# Altium project MU-RK3576J-MB.PrjPCB (part 5 of 13)

## Sheet CPU_GPIO.SchDoc
size 420 x 297 mm; Scale: 1:1; DocumentType: Схема электрическая принципиальная; SheetNumber: 11; SheetTotal: 32; DocumentTypeShort: Э3; DocumentInvertoryNumber: ㅤ
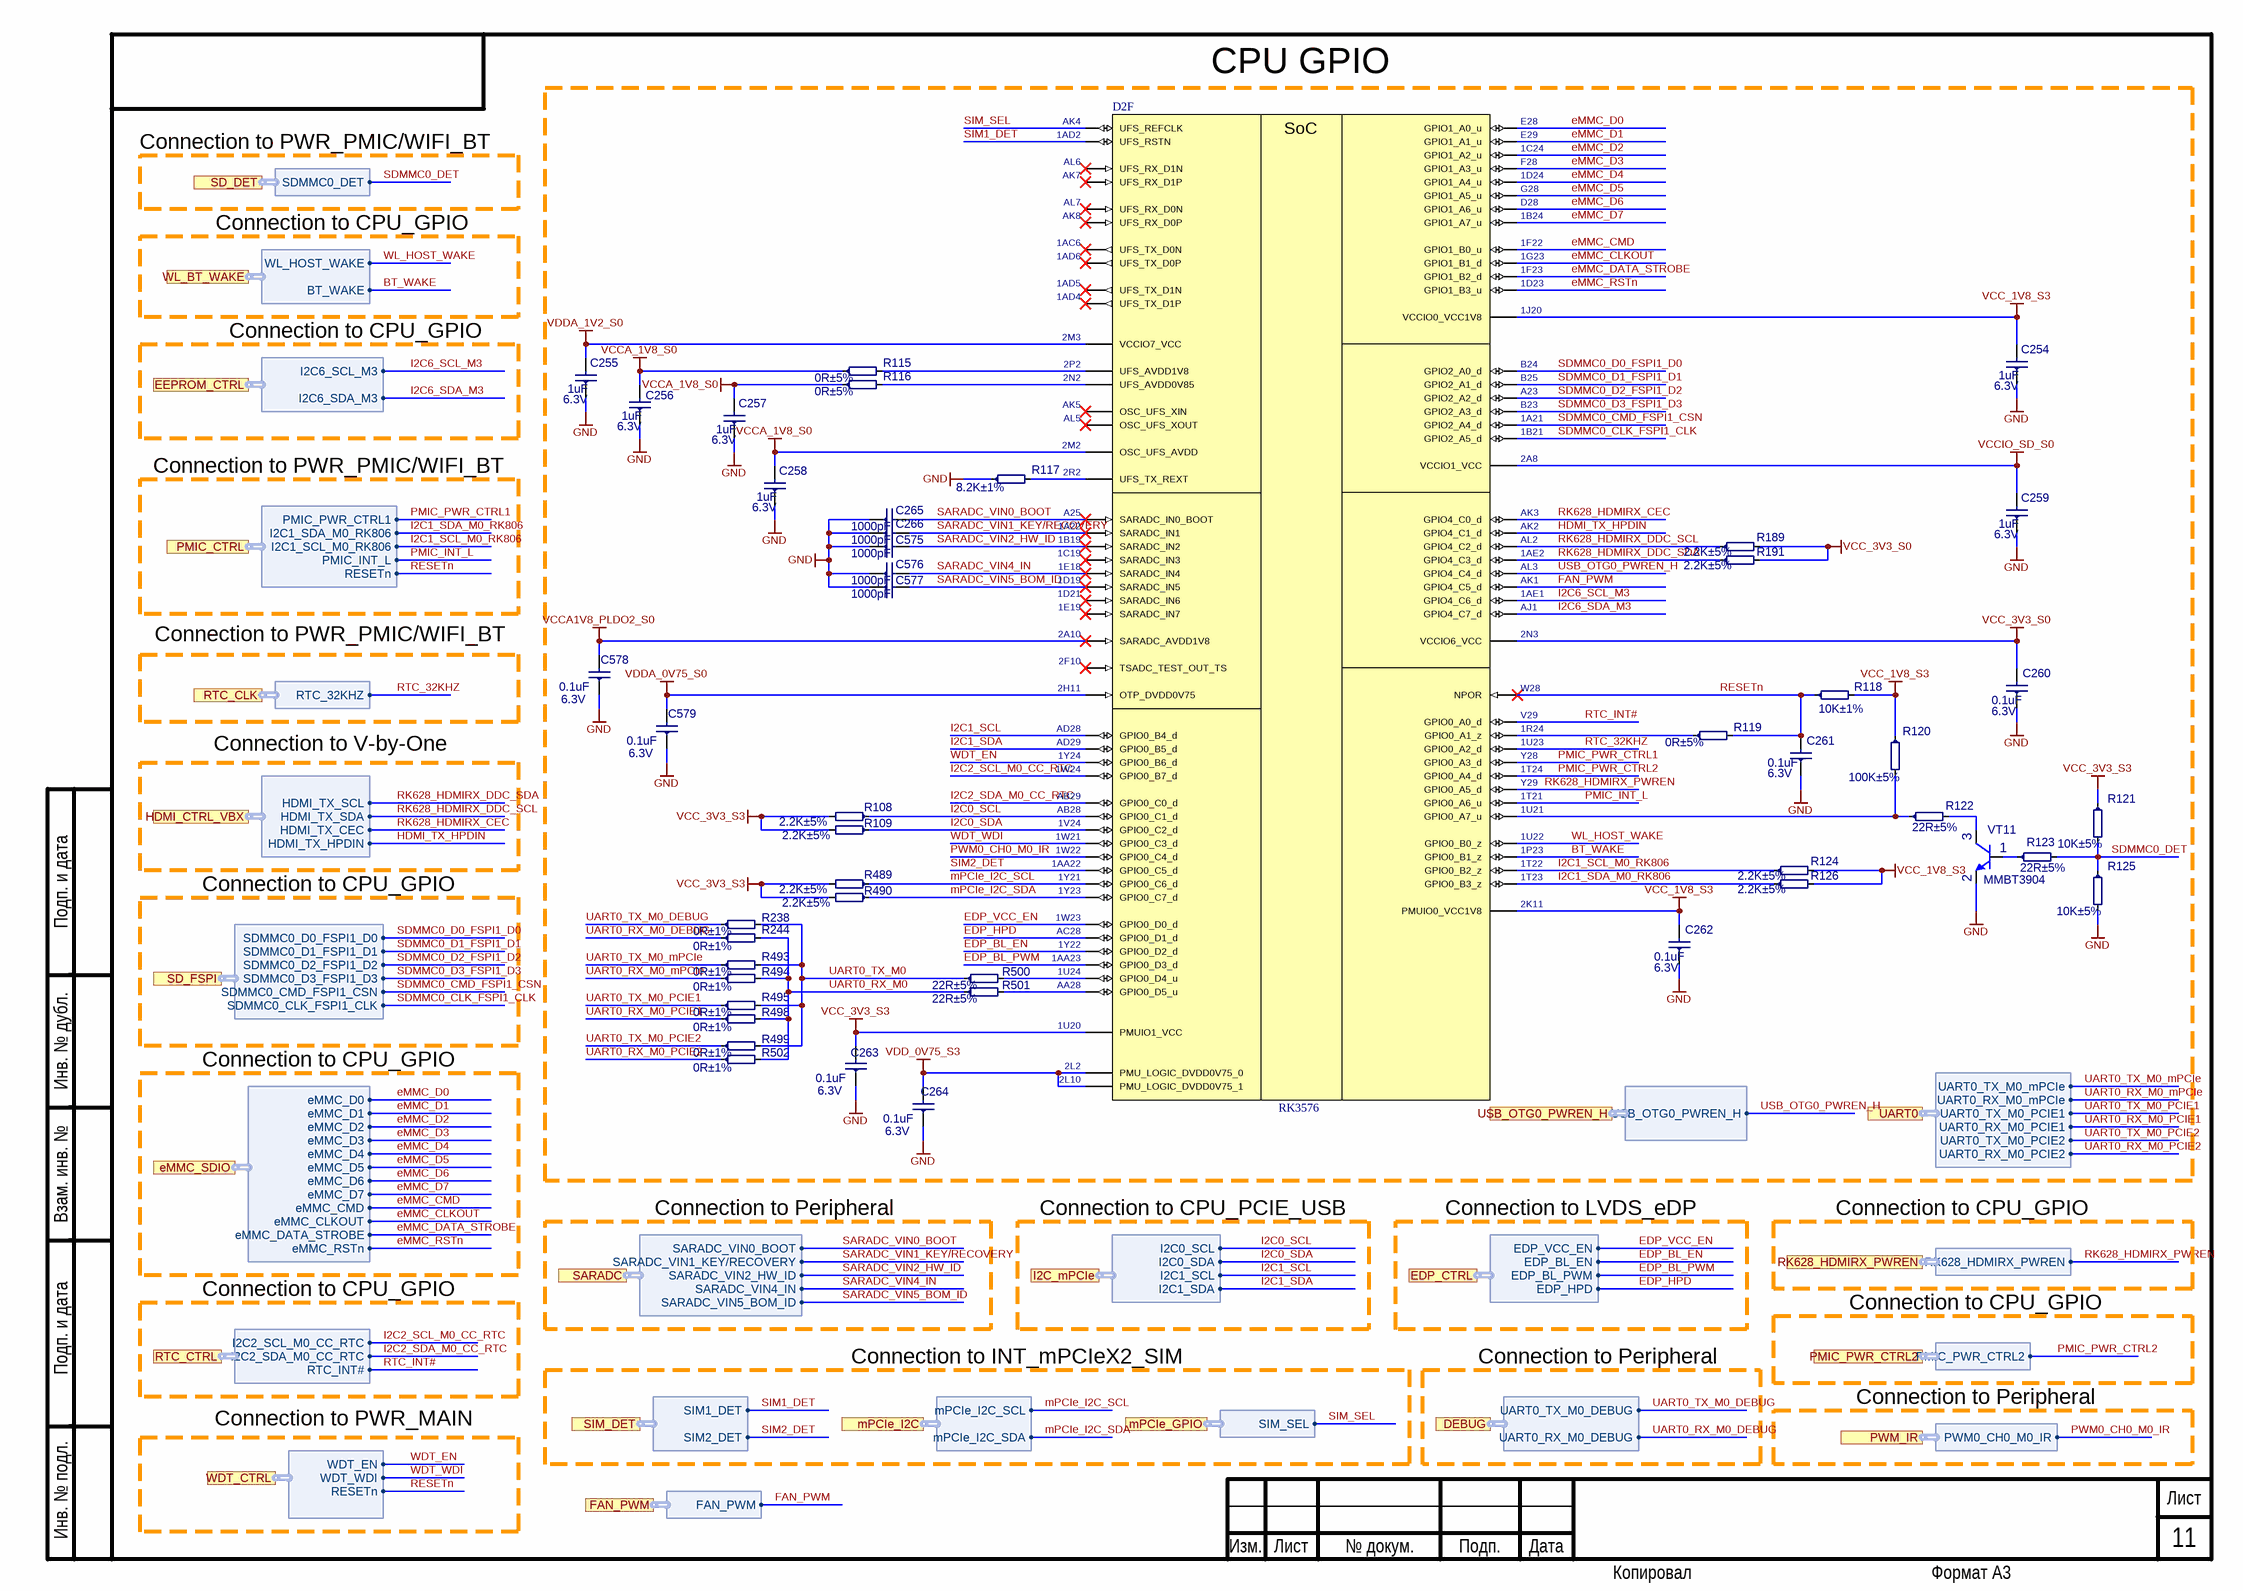
[diagram p10: CPU_GPIO.SchDoc]

### Parts
C254  1uF  Voltage: 6.3V  [C0201]
C255  1uF  Voltage: 6.3V  [C0201]
C256  1uF  Voltage: 6.3V  [C0201]
C257  1uF  Voltage: 6.3V  [C0201]
C258  1uF  Voltage: 6.3V  [C0201]
C259  1uF  Voltage: 6.3V  [C0201]
C260  0.1uF  Voltage: 6.3V  [C0201]
C261  0.1uF  Voltage: 6.3V  [C0201]
C262  0.1uF  Voltage: 6.3V  [C0201]
C263  0.1uF  Voltage: 6.3V  [C0201]
C264  0.1uF  Voltage: 6.3V  [C0201]
C265  1000pF  [C0201]
C266  1000pF  [C0201]
C575  1000pF  [C0201]
C576  1000pF  [C0201]
C577  1000pF  [C0201]
C578  0.1uF  Voltage: 6.3V  [C0201]
C579  0.1uF  Voltage: 6.3V  [C0201]
D2  RK3576  [BGAFCCSP698L]  (part F of 7)
R108  2.2K±5%  [R0402]
R109  2.2K±5%  [R0402]
R115  0R±5%  [R0201]
R116  0R±5%  [R0201]
R117  8.2K±1%  [R0402]
R118  10K±1%  [R0201]
R119  0R±5%  [R0201]
R120  100K±5%  [R0402]
R121  10K±5%  [R0402]
R122  22R±5%  [R0402]
R123  22R±5%  [R0402]
R124  2.2K±5%  [R0402]
R125  10K±5%  [R0402]
R126  2.2K±5%  [R0402]
R189  2.2K±5%  [R0402]
R191  2.2K±5%  [R0402]
R238  0R±1%  [R0402]
R244  0R±1%  [R0402]
R489  2.2K±5%  [R0402]
R490  2.2K±5%  [R0402]
R493  0R±1%  [R0402]
R494  0R±1%  [R0402]
R495  0R±1%  [R0402]
R498  0R±1%  [R0402]
R499  0R±1%  [R0402]
R500  22R±5%  [R0402]
R501  22R±5%  [R0402]
R502  0R±1%  [R0402]
VT11  MMBT3904  [SOT23]

### Ports
DEBUG (harness DEBUG), EDP_CTRL (harness EDP_CTRL), EEPROM_CTRL (harness EEPROM_CTRL), eMMC_SDIO (harness eMMC_SDIO), FAN_PWM (harness FAN_PWM), HDMI_CTRL_VBX (harness HDMI_CTRL_VBX), I2C_mPCIe (harness I2C_mPCIe), mPCIe_GPIO (harness mPCIe_GPIO), mPCIe_I2C (harness mPCIe_I2C), PMIC_CTRL (harness PMIC_CTRL), PMIC_PWR_CTRL2 (harness PMIC_PWR_CTRL2), PWM_IR (harness PWM0_IR), RK628_HDMIRX_PWREN (harness RK628_HDMIRX_PWREN), RTC_CLK (harness RTC_CLK), RTC_CTRL (harness RTC_CTRL), SARADC (harness SARADC), SD_DET (harness SD_DET), SD_FSPI (harness SD_FSPI), SIM_DET (harness SIM_DET), UART0 (harness UART0), USB_OTG0_PWREN_H (harness USB_OTG0_PWREN_H), WDT_CTRL (harness WDT_CTRL), WL_BT_WAKE (harness WL_BT_WAKE)

### Harnesses
WDT_CTRL: WDT_WDI, WDT_EN, RESETn
RTC_CLK: RTC_32KHZ
RTC_CTRL: I2C2_SCL_M0_CC_RTC, I2C2_SDA_M0_CC_RTC, RTC_INT#
eMMC_SDIO: eMMC_D0, eMMC_D1, eMMC_D2, eMMC_D3, eMMC_D4, eMMC_D5, eMMC_D6, eMMC_D7, eMMC_CMD, eMMC_CLKOUT, eMMC_DATA_STROBE, eMMC_RSTn
SD_FSPI: SDMMC0_D0_FSPI1_D0, SDMMC0_D1_FSPI1_D1, SDMMC0_D2_FSPI1_D2, SDMMC0_D3_FSPI1_D3, SDMMC0_CMD_FSPI1_CSN, SDMMC0_CLK_FSPI1_CLK
EEPROM_CTRL: I2C6_SCL_M3, I2C6_SDA_M3
SD_DET: SDMMC0_DET
WL_BT_WAKE: WL_HOST_WAKE, BT_WAKE
HDMI_CTRL_VBX: HDMI_TX_SDA, HDMI_TX_CEC, HDMI_TX_SCL, HDMI_TX_HPDIN
EDP_CTRL: EDP_BL_EN, EDP_BL_PWM, EDP_VCC_EN, EDP_HPD
SARADC: SARADC_VIN4_IN, SARADC_VIN2_HW_ID, SARADC_VIN1_KEY/RECOVERY, SARADC_VIN0_BOOT, SARADC_VIN5_BOM_ID
PMIC_CTRL: I2C1_SDA_M0_RK806, I2C1_SCL_M0_RK806, PMIC_PWR_CTRL1, PMIC_INT_L, RESETn
mPCIe_GPIO: SIM_SEL
SIM_DET: SIM1_DET, SIM2_DET
mPCIe_I2C: mPCIe_I2C_SDA, mPCIe_I2C_SCL
RK628_HDMIRX_PWREN: RK628_HDMIRX_PWREN
PMIC_PWR_CTRL2: PMIC_PWR_CTRL2
PWM0_IR: PWM0_CH0_M0_IR
I2C_mPCIe: I2C0_SDA, I2C1_SCL, I2C0_SCL, I2C1_SDA
DEBUG: UART0_RX_M0_DEBUG, UART0_TX_M0_DEBUG
FAN_PWM: FAN_PWM
UART0: UART0_RX_M0_PCIE2, UART0_TX_M0_PCIE2, UART0_RX_M0_PCIE1, UART0_TX_M0_PCIE1, UART0_RX_M0_mPCIe, UART0_TX_M0_mPCIe
USB_OTG0_PWREN_H: USB_OTG0_PWREN_H

### Nets
GND: C254.1 C255.1 C256.1 C257.1 C258.1 C259.1 C260.1 C261.1 C262.1 C263.1 C264.1 C265.1 C266.1 C575.1 C576.1 C577.1 C578.1 C579.1 R117.1 R125.2 VT11.2(E)
VCC_1V8_S3: C254.2 C262.2 D2.1J20(VCCIO0_VCC1V8) D2.2K11(PMUIO0_VCC1V8) R118.2 R120.1 R124.2 R126.2
VCC_3V3_S0: C260.2 D2.2N3(VCCIO6_VCC) R189.2 R191.2
VCC_3V3_S3: C263.2 D2.1U20(PMUIO1_VCC) R108.2 R109.2 R121.1 R489.2 R490.2
VCCA1V8_PLDO2_S0: C578.2 D2.2A10(SARADC_AVDD1V8)
VCCA_1V8_S0: C256.2 C257.2 C258.2 D2.2M2(OSC_UFS_AVDD) R115.1 R116.1
VCCIO_SD_S0: C259.2 D2.2A8(VCCIO1_VCC)
VDD_0V75_S3: C264.2 D2.2L2(PMU_LOGIC_DVDD0V75_0) D2.2L10(PMU_LOGIC_DVDD0V75_1)
VDDA_0V75_S0: C579.2 D2.2H11(OTP_DVDD0V75)
VDDA_1V2_S0: C255.2 D2.2M3(VCCIO7_VCC)
BT_WAKE: D2.1P23(GPIO0_B1_z) ; port WL_BT_WAKE.BT_WAKE
EDP_BL_EN: D2.1Y22(GPIO0_D2_d) ; port EDP_CTRL.EDP_BL_EN
EDP_BL_PWM: D2.1AA23(GPIO0_D3_d) ; port EDP_CTRL.EDP_BL_PWM
EDP_HPD: D2.AC28(GPIO0_D1_d) ; port EDP_CTRL.EDP_HPD  [project net EDP_CTRL.EDP_HPD]
EDP_VCC_EN: D2.1W23(GPIO0_D0_d) ; port EDP_CTRL.EDP_VCC_EN  [project net EDP_CTRL.EDP_VCC_EN]
eMMC_CLKOUT: D2.1G23(GPIO1_B1_d) ; port eMMC_SDIO.eMMC_CLKOUT
eMMC_CMD: D2.1F22(GPIO1_B0_u) ; port eMMC_SDIO.eMMC_CMD
eMMC_D0: D2.E28(GPIO1_A0_u) ; port eMMC_SDIO.eMMC_D0
eMMC_D1: D2.E29(GPIO1_A1_u) ; port eMMC_SDIO.eMMC_D1
eMMC_D2: D2.1C24(GPIO1_A2_u) ; port eMMC_SDIO.eMMC_D2
eMMC_D3: D2.F28(GPIO1_A3_u) ; port eMMC_SDIO.eMMC_D3
eMMC_D4: D2.1D24(GPIO1_A4_u) ; port eMMC_SDIO.eMMC_D4
eMMC_D5: D2.G28(GPIO1_A5_u) ; port eMMC_SDIO.eMMC_D5
eMMC_D6: D2.D28(GPIO1_A6_u) ; port eMMC_SDIO.eMMC_D6
eMMC_D7: D2.1B24(GPIO1_A7_u) ; port eMMC_SDIO.eMMC_D7
eMMC_DATA_STROBE: D2.1F23(GPIO1_B2_d) ; port eMMC_SDIO.eMMC_DATA_STROBE
eMMC_RSTn: D2.1D23(GPIO1_B3_u) ; port eMMC_SDIO.eMMC_RSTn
FAN_PWM: D2.AK1(GPIO4_C5_d) ; port FAN_PWM.FAN_PWM
HDMI_TX_HPDIN: D2.AK2(GPIO4_C1_d) ; port HDMI_CTRL_VBX.HDMI_TX_HPDIN  [project net HDMI_CTRL_VBX.HDMI_TX_HPDIN]
I2C0_SCL: D2.AB28(GPIO0_C1_d) R108.1 ; port I2C_mPCIe.I2C0_SCL
I2C0_SDA: D2.1V24(GPIO0_C2_d) R109.1 ; port I2C_mPCIe.I2C0_SDA
I2C1_SCL: D2.AD28(GPIO0_B4_d) ; port I2C_mPCIe.I2C1_SCL
I2C1_SCL_M0_RK806: D2.1T22(GPIO0_B2_z) R124.1 ; port PMIC_CTRL.I2C1_SCL_M0_RK806
I2C1_SDA: D2.AD29(GPIO0_B5_d) ; port I2C_mPCIe.I2C1_SDA
I2C1_SDA_M0_RK806: D2.1T23(GPIO0_B3_z) R126.1 ; port PMIC_CTRL.I2C1_SDA_M0_RK806
I2C2_SCL_M0_CC_RTC: D2.1W24(GPIO0_B7_d) ; port RTC_CTRL.I2C2_SCL_M0_CC_RTC
I2C2_SDA_M0_CC_RTC: D2.AB29(GPIO0_C0_d) ; port RTC_CTRL.I2C2_SDA_M0_CC_RTC
I2C6_SCL_M3: D2.1AE1(GPIO4_C6_d) ; port EEPROM_CTRL.I2C6_SCL_M3  [project net EEPROM_CTRL.I2C6_SCL_M3]
I2C6_SDA_M3: D2.AJ1(GPIO4_C7_d) ; port EEPROM_CTRL.I2C6_SDA_M3  [project net EEPROM_CTRL.I2C6_SDA_M3]
mPCIe_I2C_SCL: D2.1Y21(GPIO0_C6_d) R489.1 ; port mPCIe_I2C.mPCIe_I2C_SCL  [project net mPCIe_I2C.mPCIe_I2C_SCL]
mPCIe_I2C_SDA: D2.1Y23(GPIO0_C7_d) R490.1 ; port mPCIe_I2C.mPCIe_I2C_SDA  [project net mPCIe_I2C.mPCIe_I2C_SDA]
PMIC_INT_L: D2.1T21(GPIO0_A6_u) ; port PMIC_CTRL.PMIC_INT_L  [project net PMIC_CTRL.PMIC_INT_L]
PMIC_PWR_CTRL1: D2.Y28(GPIO0_A3_d) ; port PMIC_CTRL.PMIC_PWR_CTRL1  [project net PMIC_CTRL.PMIC_PWR_CTRL1]
PMIC_PWR_CTRL2: D2.1T24(GPIO0_A4_d) ; port PMIC_PWR_CTRL2.PMIC_PWR_CTRL2
PWM0_CH0_M0_IR: D2.1W22(GPIO0_C4_d) ; port PWM_IR.PWM0_CH0_M0_IR
RESETn: C261.2 D2.W28(NPOR) R118.1 R119.2 ; port WDT_CTRL.RESETn, port PMIC_CTRL.RESETn  [project net PMIC_CTRL.RESETn]
RK628_HDMIRX_CEC: D2.AK3(GPIO4_C0_d) ; port HDMI_CTRL_VBX.HDMI_TX_CEC  [project net HDMI_CTRL_VBX.HDMI_TX_CEC]
RK628_HDMIRX_DDC_SCL: D2.AL2(GPIO4_C2_d) R189.1 ; port HDMI_CTRL_VBX.HDMI_TX_SDA  [project net HDMI_CTRL_VBX.HDMI_TX_SDA]
RK628_HDMIRX_DDC_SDA: D2.1AE2(GPIO4_C3_d) R191.1 ; port HDMI_CTRL_VBX.HDMI_TX_SCL  [project net HDMI_CTRL_VBX.HDMI_TX_SCL]
RK628_HDMIRX_PWREN: D2.Y29(GPIO0_A5_d) ; port RK628_HDMIRX_PWREN.RK628_HDMIRX_PWREN
RTC_32KHZ: D2.1U23(GPIO0_A2_d) ; port RTC_CLK.RTC_32KHZ
RTC_INT#: D2.V29(GPIO0_A0_d) ; port RTC_CTRL.RTC_INT#  [project net RTC_CTRL.RTC_INT#]
SARADC_VIN0_BOOT: C265.2 D2.A25(SARADC_IN0_BOOT) ; port SARADC.SARADC_VIN0_BOOT  [project net SARADC.SARADC_VIN0_BOOT]
SARADC_VIN1_KEY/RECOVERY: C266.2 D2.1A22(SARADC_IN1) ; port SARADC.SARADC_VIN1_KEY/RECOVERY  [project net SARADC.SARADC_VIN1_KEY/RECOVERY]
SARADC_VIN2_HW_ID: C575.2 D2.1B19(SARADC_IN2) ; port SARADC.SARADC_VIN2_HW_ID  [project net SARADC.SARADC_VIN2_HW_ID]
SARADC_VIN4_IN: C576.2 D2.1E18(SARADC_IN4) ; port SARADC.SARADC_VIN4_IN  [project net SARADC.SARADC_VIN4_IN]
SARADC_VIN5_BOM_ID: C577.2 D2.1D19(SARADC_IN5) ; port SARADC.SARADC_VIN5_BOM_ID  [project net SARADC.SARADC_VIN5_BOM_ID]
SDMMC0_CLK_FSPI1_CLK: D2.1B21(GPIO2_A5_d) ; port SD_FSPI.SDMMC0_CLK_FSPI1_CLK  [project net SD_FSPI.SDMMC0_CLK_FSPI1_CLK]
SDMMC0_CMD_FSPI1_CSN: D2.1A21(GPIO2_A4_d) ; port SD_FSPI.SDMMC0_CMD_FSPI1_CSN  [project net SD_FSPI.SDMMC0_CMD_FSPI1_CSN]
SDMMC0_D0_FSPI1_D0: D2.B24(GPIO2_A0_d) ; port SD_FSPI.SDMMC0_D0_FSPI1_D0  [project net SD_FSPI.SDMMC0_D0_FSPI1_D0]
SDMMC0_D1_FSPI1_D1: D2.B25(GPIO2_A1_d) ; port SD_FSPI.SDMMC0_D1_FSPI1_D1  [project net SD_FSPI.SDMMC0_D1_FSPI1_D1]
SDMMC0_D2_FSPI1_D2: D2.A23(GPIO2_A2_d) ; port SD_FSPI.SDMMC0_D2_FSPI1_D2  [project net SD_FSPI.SDMMC0_D2_FSPI1_D2]
SDMMC0_D3_FSPI1_D3: D2.B23(GPIO2_A3_d) ; port SD_FSPI.SDMMC0_D3_FSPI1_D3  [project net SD_FSPI.SDMMC0_D3_FSPI1_D3]
SDMMC0_DET: R121.2 R123.2 R125.1 ; port SD_DET.SDMMC0_DET  [project net SD_DET.SDMMC0_DET]
SIM1_DET: D2.1AD2(UFS_RSTN) ; port SIM_DET.SIM1_DET
SIM2_DET: D2.1AA22(GPIO0_C5_d) ; port SIM_DET.SIM2_DET
SIM_SEL: D2.AK4(UFS_REFCLK) ; port mPCIe_GPIO.SIM_SEL  [project net mPCIe_GPIO.SIM_SEL]
UART0_RX_M0: R244.2 R494.2 R498.2 R501.1 R502.2
UART0_RX_M0_DEBUG: R244.1 ; port DEBUG.UART0_RX_M0_DEBUG  [project net DEBUG.UART0_RX_M0_DEBUG]
UART0_RX_M0_mPCIe: R494.1 ; port UART0.UART0_RX_M0_mPCIe  [project net UART0.UART0_RX_M0_mPCIe]
UART0_RX_M0_PCIE1: R498.1 ; port UART0.UART0_RX_M0_PCIE1  [project net UART0.UART0_RX_M0_PCIE1]
UART0_RX_M0_PCIE2: R502.1 ; port UART0.UART0_RX_M0_PCIE2  [project net UART0.UART0_RX_M0_PCIE2]
UART0_TX_M0: R238.2 R493.2 R495.2 R499.2 R500.1
UART0_TX_M0_DEBUG: R238.1 ; port DEBUG.UART0_TX_M0_DEBUG  [project net DEBUG.UART0_TX_M0_DEBUG]
UART0_TX_M0_mPCIe: R493.1 ; port UART0.UART0_TX_M0_mPCIe  [project net UART0.UART0_TX_M0_mPCIe]
UART0_TX_M0_PCIE1: R495.1 ; port UART0.UART0_TX_M0_PCIE1  [project net UART0.UART0_TX_M0_PCIE1]
UART0_TX_M0_PCIE2: R499.1 ; port UART0.UART0_TX_M0_PCIE2  [project net UART0.UART0_TX_M0_PCIE2]
USB_OTG0_PWREN_H: D2.AL3(GPIO4_C4_d) ; port USB_OTG0_PWREN_H.USB_OTG0_PWREN_H
WDT_EN: D2.1Y24(GPIO0_B6_d) ; port WDT_CTRL.WDT_EN  [project net WDT_CTRL.WDT_EN]
WDT_WDI: D2.1W21(GPIO0_C3_d) ; port WDT_CTRL.WDT_WDI  [project net WDT_CTRL.WDT_WDI]
WL_HOST_WAKE: D2.1U22(GPIO0_B0_z) ; port WL_BT_WAKE.WL_HOST_WAKE  [project net WL_BT_WAKE.WL_HOST_WAKE]
NetD2_1R24: D2.1R24(GPIO0_A1_z) R119.1
NetD2_1U21: D2.1U21(GPIO0_A7_u) R120.2 R122.1
NetD2_1U24: D2.1U24(GPIO0_D4_u) R500.2
NetD2_2N2: D2.2N2(UFS_AVDD0V85) R116.2
NetD2_2P2: D2.2P2(UFS_AVDD1V8) R115.2
NetD2_2R2: D2.2R2(UFS_TX_REXT) R117.2
NetD2_AA28: D2.AA28(GPIO0_D5_u) R501.2
NetR122_2: R122.2 VT11.3(C)
NetR123_1: R123.1 VT11.1(B)

Not connected (* = marked no-connect by the designer): D2 1AC6(UFS_TX_D0N)* 1AD4(UFS_TX_D1P)* 1AD5(UFS_TX_D1N)* 1AD6(UFS_TX_D0P)* 1C19(SARADC_IN3)* 1D21(SARADC_IN6)* 1E19(SARADC_IN7)* 2F10(TSADC_TEST_OUT_TS)* AK5(OSC_UFS_XIN)* AK7(UFS_RX_D1P)* AK8(UFS_RX_D0P)* AL5(OSC_UFS_XOUT)* AL6(UFS_RX_D1N)* AL7(UFS_RX_D0N)*

### Notes on the sheet
- (near D2) CPU GPIO
- Connection to PWR_PMIC/WIFI_BT
- Connection to CPU_GPIO
- Connection to V-by-One
- Connection to Peripheral
- Connection to CPU_PCIE_USB
- Connection to LVDS_eDP
- Connection to INT_mPCIeX2_SIM
- Connection to PWR_MAIN
- Подп. и дата
- Инв. № дубл.
- Взам. инв. №
- Инв. № подл.
- Изм.
- Лист
- № докум.
- Подп.
- Дата
- Копировал
- Формат А3
- (in symbol RK3576, part F) SoC

### Library data of the parts
C254-C259 = 0201-X5R-6.3V-1uF±20%: Manufacturer: Murata Electronics; NameFromManufacturer: GRM033R60J105MEA2D; Dielectric: X5R; Place: *); Tolerance: 20%; Check: False; Case: C0201; Part Number: 0201-X5R-6.3V-1uF±20%; Value: 1uF; Temperature: -55°C~85°C; ComponentLink2Description: Link to datasheet; ComponentLink1Description: DATASHEET; ComponentLink2URL: https://www.terraelectronica.ru/product/1209278; ComponentLink1URL: Datasheets/capacitors/GRM033R60J105MEA2-61A.pdf; Last changed: 27.10.2022
C260-C264 C578 C579 = 0201-X5R-6.3V-0.1uF±10%: Manufacturer: Yageo; NameFromManufacturer: CC0201KRX5R5BB104; Dielectric: X5R; Place: *); Tolerance: 10%; Check: False; Case: C0201; Part Number: 0201-X5R-6.3V-0.1uF±10%; Value: 0.1uF; Temperature: -55°C~85°C; ComponentLink2Description: Link to datasheet; ComponentLink1Description: DATASHEET; ComponentLink2URL: https://www.terraelectronica.ru/product/1020032; ComponentLink1URL: Datasheets/capacitors/UPY-GPHC_X5R_4V-to-50V_27.pdf; Last changed: 27.10.2022
C265 C266 C575-C577 = 0201-C0G-25V-100pF±5%: *; Part Number: 0201-C0G-25V-1000pF±10%; Manufacturer: Yageo; NameFromManufacturer: CC0201KRX7R9BB102; Dielectric: C0G; Voltage: 25V; Place: *); Tolerance: 10%; Check: False; Case: C0201; Value: 1000pF; Temperature: -55°C~125°C; ComponentLink2Description: Link to datasheet; ComponentLink1Description: DATASHEET; ComponentLink2URL: https://ru.mouser.com/ProductDetail/YAGEO/CC0201JRNPO8BN101?qs=%2Fha2pyFaduhl6p6a7Jtfij5kOT7C0BCbN0eDEcSOi5wWtTVDmUsGTw%3D%3D; ComponentLink1URL: Datasheets/capacitors/UPY-GP_NP0_16V-to-50V_18.pdf; Last changed: 27.10.2022
D2 = RK3576: SoC 4xCortex-A72@2.2Ghz+4xCortex-A53@2Ghz, LPDDR4/4X/5/5X, SDIO/eMMC/UFS/FSPI, BGA 16.1x17.2x1.0mm; Manufacturer: Rockship; Place: *); Check: False; Part Number: RK3576; Temperature: -40°C~85°C; Value: RK3576; ComponentLink1Description: DATASHEET; NameFromManufacturer: RK3576; ComponentLink1URL: https://wiki.friendlyelec.com/wiki/images/b/bf/Rockchip_RK3576_Datasheet_V1.5-20241216.pdf; Last changed: 06.01.2026
R108 R109 R124 R126 R189 R191 R489 R490 = 0402-0.0625W-2.2K-100ppm±5%: *; NameFromManufacturer: RC0402JR-072K2L; Manufacturer: Yageo; Place: *); Value: 2.2K; Tolerance: 5%; Check: False; Case: R0402; Part Number: 0402-0.0625W-2.2K-100ppm±5%; Temperature: -55°C~155°C; ComponentLink1Description: DATASHEET; ComponentLink1URL: https://octopart.com/ac0402jr-072k2l-yageo-23514430?r=sp; Datasheet: Datasheets/resistors/PYu-AC_51_RoHS_L_8.pdf; Last changed: 27.10.2022
R115 R116 R119 = 0201-0.05W-0R-100ppm-5%: *; NameFromManufacturer: RC0201JR-070RL; Manufacturer: Yageo; Place: *); Value: 0R; Tolerance: 5%; Check: False; Case: R0201; Part Number: 0201-0.05W-0R-100ppm-5%; Temperature: -40°C~125°C; ComponentLink1Description: DATASHEET; ComponentLink1URL: https://www.digikey.com/en/products/detail/yageo/RC0201JR-070RL/1948898; Datasheet: Datasheets/resistors/PYu-RC_Group_51_RoHS_L_11.pdf+BB3:B271; Last changed: 27.10.2022
R117 = 0402-0.0625W-8.2K-100ppm±1%: NameFromManufacturer: RC0402FR-078K2L; Manufacturer: Yageo; Place: *); Value: 8.2K; Tolerance: 1%; Check: False; Case: R0402; Part Number: 0402-0.0625W-8.2K-100ppm±1%; Temperature: -55°C~155°C; ComponentLink1Description: DATASHEET; ComponentLink1URL: https://www.compel.ru/infosheet/YAG/RC0402FR-078K2L; Datasheet: Datasheets/resistors/PYu-RC_Group_51_RoHS_L_11.pdf; Last changed: 27.10.2022
R118 = 0201-0.05W-10K-200ppm-1%: *; NameFromManufacturer: RC0201FR-0710KL; Manufacturer: Yageo; Place: *); Value: 10K; Tolerance: 1%; Check: False; Case: R0201; Part Number: 0201-0.05W-10K-200ppm-1%; Temperature: -40°C~125°C; ComponentLink1Description: DATASHEET; ComponentLink1URL: https://www.terraelectronica.ru/product/597744; Datasheet: Datasheets/resistors/PYu-RC_Group_51_RoHS_L_11.pdf; Last changed: 09.11.2022
R120 = 0402-0.0625W-100K-100ppm±5%: NameFromManufacturer: RC0402JR-07100KL; Manufacturer: Yageo; Place: *); Value: 100K; Tolerance: 5%; Check: False; Case: R0402; Part Number: 0402-0.0625W-100K-100ppm±5%; Temperature: -55°C~155°C; ComponentLink1Description: DATASHEET; ComponentLink1URL: https://ru.mouser.com/ProductDetail/YAGEO/RC0402JR-07100KL?qs=%2Fha2pyFadugNN0LzwXn2qCsICuw6vgLBeLL%252BmXUKy2OLGS9kgqrNBA%3D%3D; Datasheet: Datasheets/resistors/PYu-RC_Group_51_RoHS_L_11.pdf; Last changed: 27.10.2022
R121 R125 = 0402-0.0625W-10K-100ppm±5%: NameFromManufacturer: RC0402JR-0710KL; Manufacturer: Yageo; Place: *); Value: 10K; Tolerance: 5%; Check: False; Case: R0402; Part Number: 0402-0.0625W-10K-100ppm±5%; Temperature: -55°C~155°C; ComponentLink1Description: DATASHEET; ComponentLink1URL: https://ru.mouser.com/ProductDetail/YAGEO/RC0402JR-0710KL?qs=%2Fha2pyFadugNN0LzwXn2qF8HRAp201xOpXu%252BapQnyvRGE%2F%252Bpr1TWjQ%3D%3D; Datasheet: Datasheets/resistors/PYu-RC_Group_51_RoHS_L_11.pdf; Last changed: 27.10.2022
R122 R123 R500 R501 = 0402-0.0625W-22R-100ppm±5%: NameFromManufacturer: RC0402JR-0722RL; Manufacturer: Yageo; Place: *); Value: 22R; Tolerance: 5%; Check: False; Case: R0402; Part Number: 0402-0.0625W-22R-100ppm±5%; Temperature: -55°C~155°C; ComponentLink1Description: DATASHEET; ComponentLink1URL: https://www.terraelectronica.ru/pdf/show?pdf_file=%252Fds%252Fpdf%252FR%252FRC0402.pdf; Datasheet: Datasheets/resistors/PYu-RC_Group_51_RoHS_L_12.pdf; Last changed: 27.10.2022
R238 R244 R493-R495 R498 R499 R502 = 0402-0.0625W-0R-100ppm±1%: Chip Resistor 0402 0Ω ±1% 50V ±100ppm/℃ Thick Film; NameFromManufacturer: RC0402FR-070RL; Manufacturer: Yageo; Place: *); Value: 0R; Check: False; Case: R0402; Part Number: 0402-0.0625W-0R-100ppm±1%; Tolerance: 1%; Temperature: -55°C~155°C; ComponentLink1Description: DATASHEET; ComponentLink1URL: https://www.chipdip.ru/product0/8000617426?ysclid=l7og5x0plo427794326; Datasheet: Datasheets/resistors/DOC012445956.pdf; Last changed: 27.10.2022
VT11 = MMBT3904: NPN transistor; Manufacturer: Diotec Semiconductor; Place: S; Voltage: 40V; Check: False; Part Number: MMBT3904; Value: MMBT3904; Temperature: -55°C~150°C; ComponentLink1Description: DATASHEET; NameFromManufacturer: MMBT3904; ComponentLink1URL: https://www.terraelectronica.ru/product/607582; Datasheet: #https://diotec.com/request/datasheet/mmbt3904.pdf#; Last changeв: 01.09.2022

## Sheet MEMORY.SchDoc
size 420 x 297 mm; SheetNumber: 12; SheetTotal: 32; DocumentTypeShort: Э3; DocumentInvertoryNumber: ㅤ
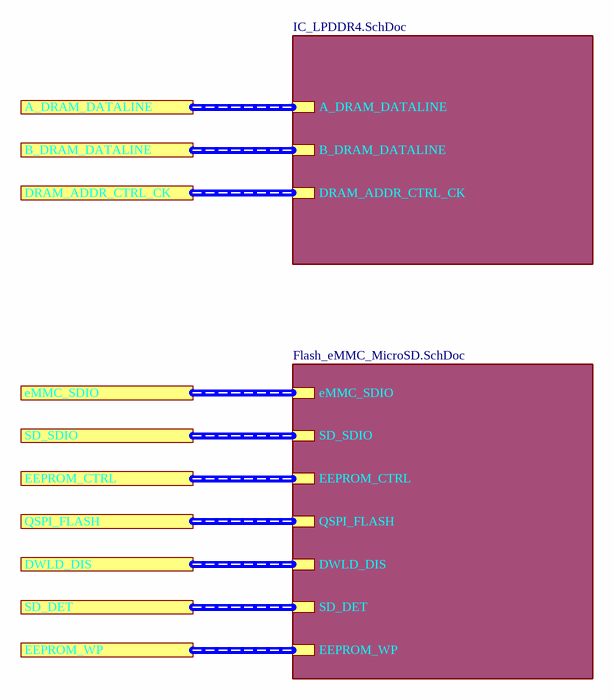
[diagram p11: MEMORY.SchDoc]

### Sub-sheets
Flash_eMMC_MicroSD = Flash_eMMC_MicroSD.SchDoc: eMMC_SDIO (harness eMMC_SDIO), SD_SDIO (harness SD_SDIO), EEPROM_CTRL (harness EEPROM_CTRL), DWLD_DIS (harness DWLD_DIS), SD_DET (harness SD_DET), QSPI_FLASH (harness QSPI_FLASH), EEPROM_WP (harness EEPROM_WP)
IC_LPDDR4 = IC_LPDDR4.SchDoc: A_DRAM_DATALINE (harness A_DRAM_DATALINE), B_DRAM_DATALINE (harness B_DRAM_DATALINE), DRAM_ADDR_CTRL_CK (harness DRAM_ADDR_CTRL_CK)

### Ports
A_DRAM_DATALINE, B_DRAM_DATALINE, DRAM_ADDR_CTRL_CK, DWLD_DIS, EEPROM_CTRL, EEPROM_WP, eMMC_SDIO, QSPI_FLASH, SD_DET, SD_SDIO

### Buses and harness runs
harness port A_DRAM_DATALINE = sheet IC_LPDDR4/A_DRAM_DATALINE
harness port B_DRAM_DATALINE = sheet IC_LPDDR4/B_DRAM_DATALINE
harness port DRAM_ADDR_CTRL_CK = sheet IC_LPDDR4/DRAM_ADDR_CTRL_CK
harness port DWLD_DIS = sheet Flash_eMMC_MicroSD/DWLD_DIS
harness port EEPROM_CTRL = sheet Flash_eMMC_MicroSD/EEPROM_CTRL
harness port EEPROM_WP = sheet Flash_eMMC_MicroSD/EEPROM_WP
harness port eMMC_SDIO = sheet Flash_eMMC_MicroSD/eMMC_SDIO
harness port QSPI_FLASH = sheet Flash_eMMC_MicroSD/QSPI_FLASH
harness port SD_DET = sheet Flash_eMMC_MicroSD/SD_DET
harness port SD_SDIO = sheet Flash_eMMC_MicroSD/SD_SDIO

### Notes on the sheet
- Подп. и дата
- Инв. № дубл.
- Взам. инв. №
- Инв. № подл.
- Изм.
- Лист
- № докум.
- Подп.
- Дата
- Копировал
- Формат А3

## Sheet IC_LPDDR4.SchDoc
size 420 x 297 mm; Title1str: Модуль; PageSetup: Record=PageOptions|CenterHorizontal=False|CenterVertical=False|PrintScale=0.95|XCorrection=0.00|YCorrection=0.00|PrintKind=1|BorderSize=5000000|LeftOffset=0|BottomOffset=0|Orientation=1|PaperLength=1000|PaperWidth=1000|Scale=100|PaperSource=15|PrintQuality=600|MediaType=1|DitherType=10|PaperKind=A4|PrintScaleMode=1; Title2str: ATB-LW-USB-GateWay; Mass: ---; Letter1Column: О; Letter2Column: {L}; DocumentType1str: {Документ}; DocumentType2str: {Документ}; SpravNomer: {Справ. №}; Scale: 1:1; DocumentType: Схема электрическая принципиальная; SheetNumber: 13; SheetTotal: 32; DocumentTypeShort: Э3; DocumentInvertoryNumber: ㅤ
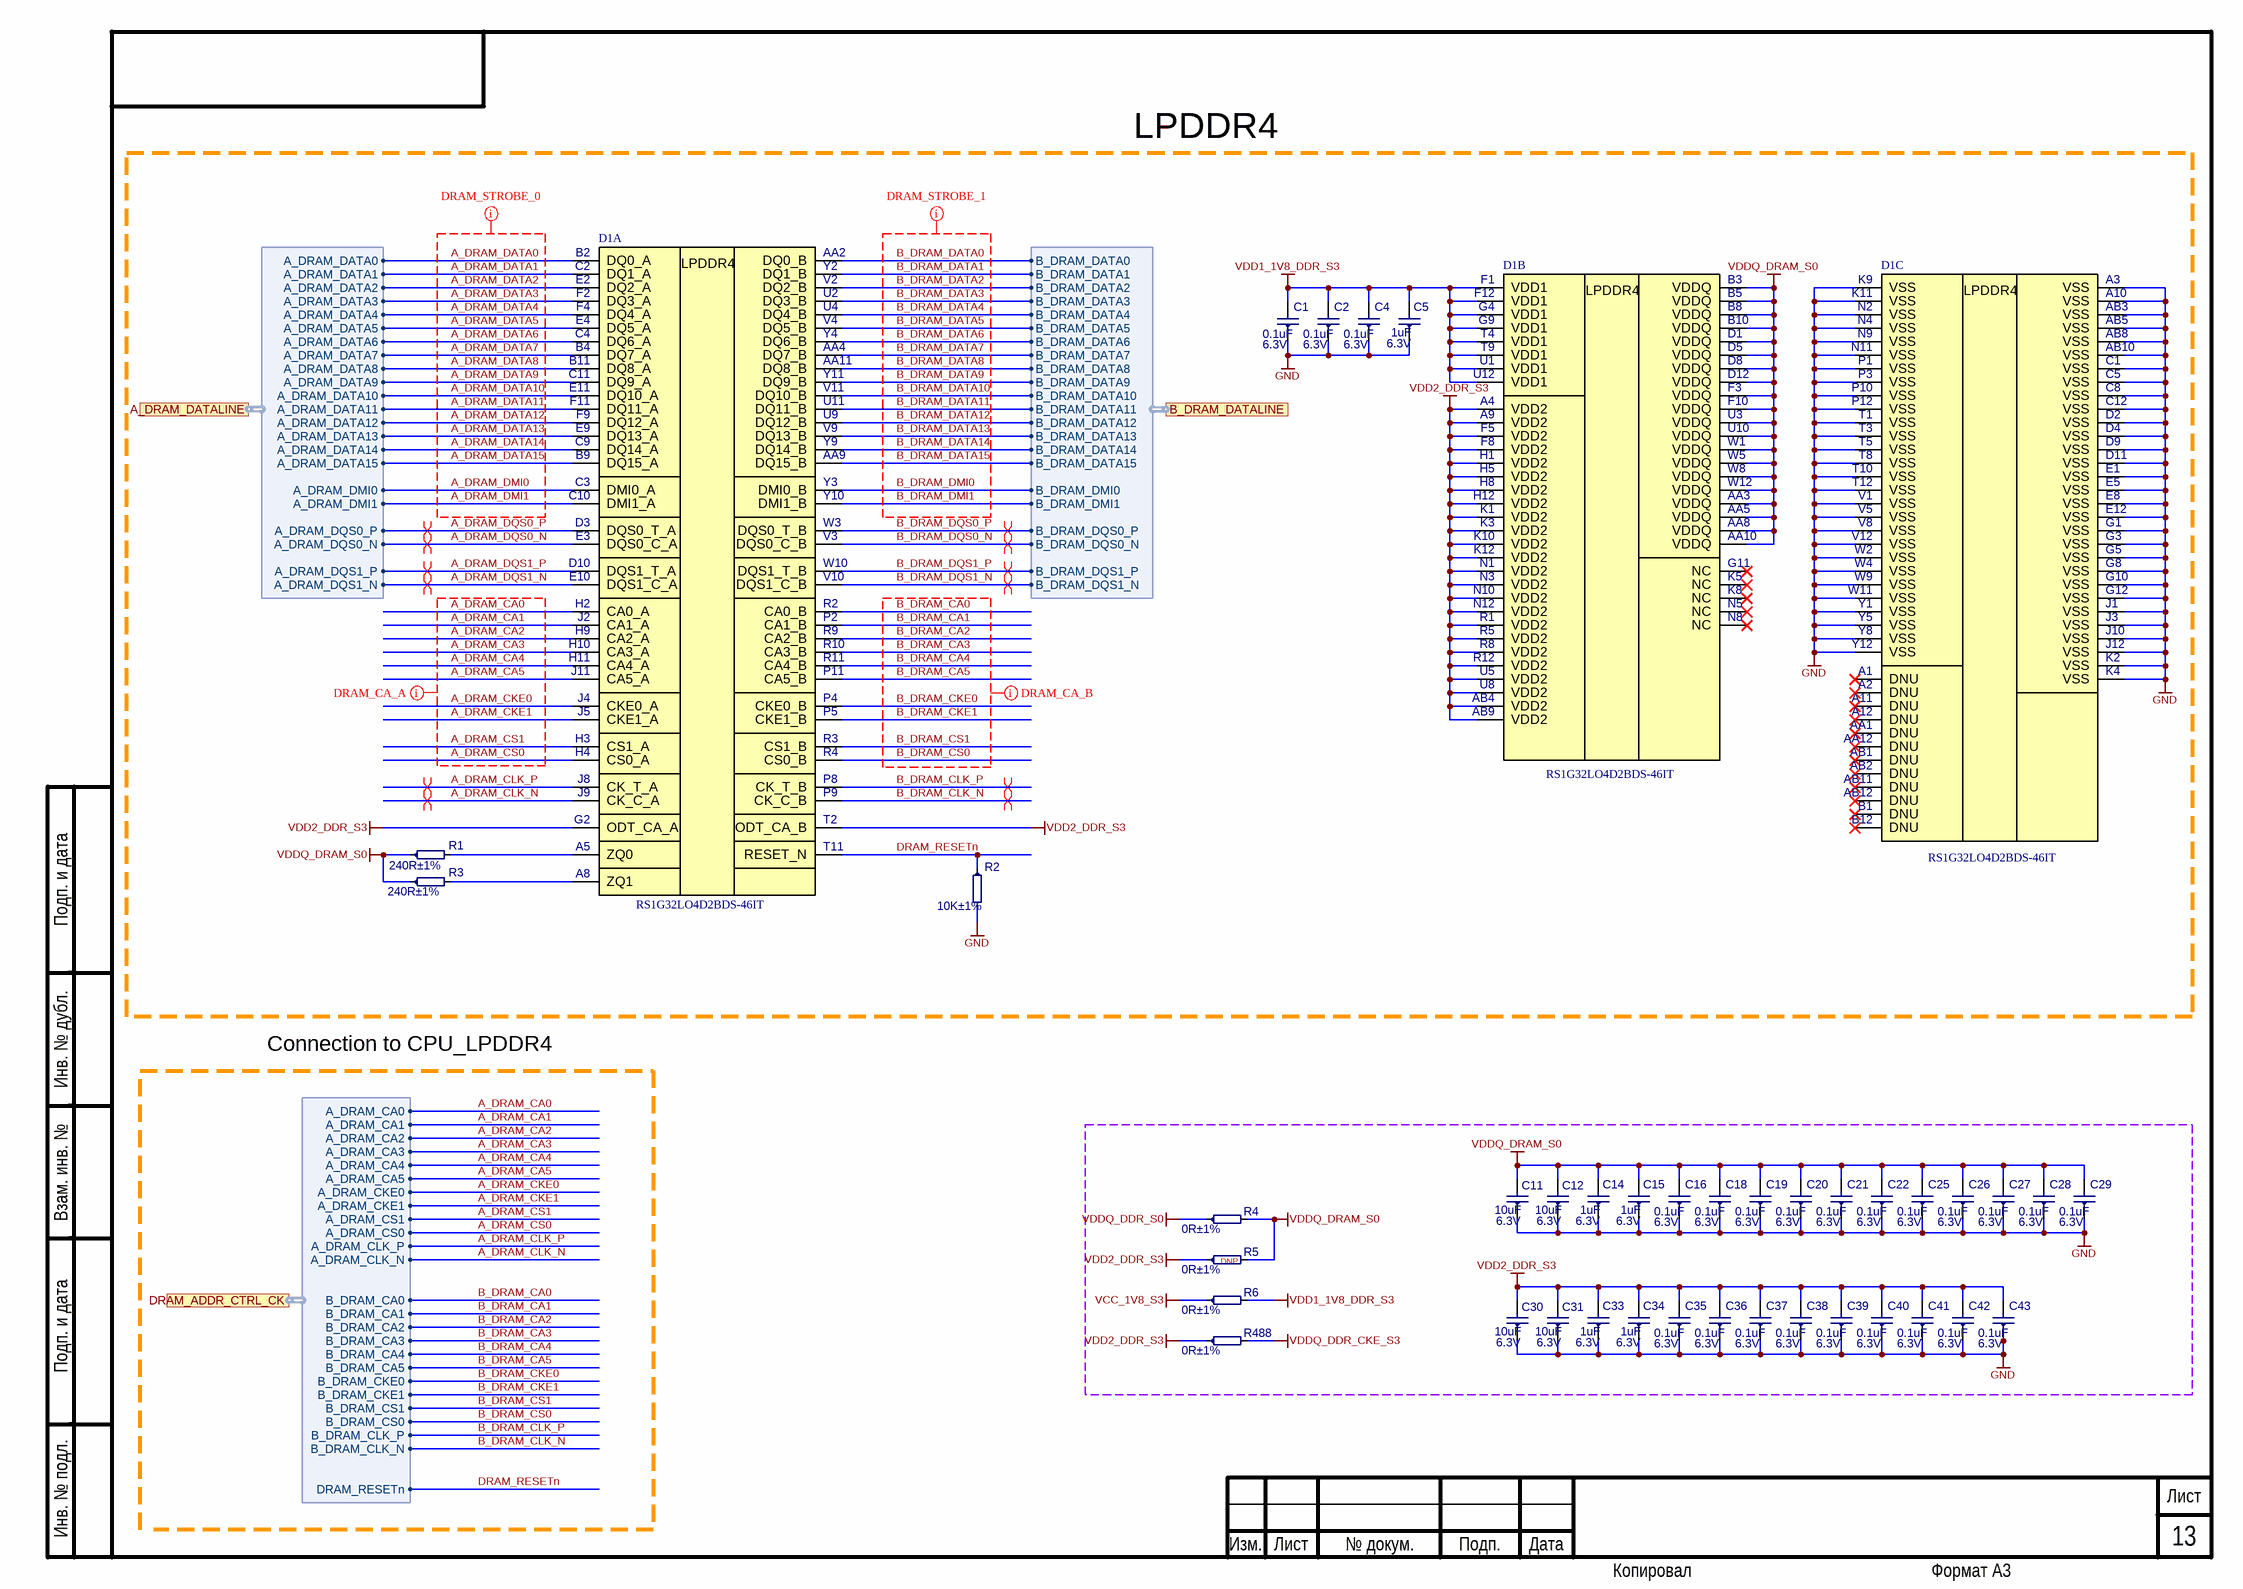
[diagram p12: IC_LPDDR4.SchDoc]

### Parts
C1  0.1uF  Voltage: 6.3V  [C0201]
C2  0.1uF  Voltage: 6.3V  [C0201]
C4  0.1uF  Voltage: 6.3V  [C0201]
C5  1uF  Voltage: 6.3V  [C0201]
C11  10uF  Voltage: 6.3V  [C0402]
C12  10uF  Voltage: 6.3V  [C0402]
C14  1uF  Voltage: 6.3V  [C0201]
C15  1uF  Voltage: 6.3V  [C0201]
C16  0.1uF  Voltage: 6.3V  [C0201]
C18  0.1uF  Voltage: 6.3V  [C0201]
C19  0.1uF  Voltage: 6.3V  [C0201]
C20  0.1uF  Voltage: 6.3V  [C0201]
C21  0.1uF  Voltage: 6.3V  [C0201]
C22  0.1uF  Voltage: 6.3V  [C0201]
C25  0.1uF  Voltage: 6.3V  [C0201]
C26  0.1uF  Voltage: 6.3V  [C0201]
C27  0.1uF  Voltage: 6.3V  [C0201]
C28  0.1uF  Voltage: 6.3V  [C0201]
C29  0.1uF  Voltage: 6.3V  [C0201]
C30  10uF  Voltage: 6.3V  [C0402]
C31  10uF  Voltage: 6.3V  [C0402]
C33  1uF  Voltage: 6.3V  [C0201]
C34  1uF  Voltage: 6.3V  [C0201]
C35  0.1uF  Voltage: 6.3V  [C0201]
C36  0.1uF  Voltage: 6.3V  [C0201]
C37  0.1uF  Voltage: 6.3V  [C0201]
C38  0.1uF  Voltage: 6.3V  [C0201]
C39  0.1uF  Voltage: 6.3V  [C0201]
C40  0.1uF  Voltage: 6.3V  [C0201]
C41  0.1uF  Voltage: 6.3V  [C0201]
C42  0.1uF  Voltage: 6.3V  [C0201]
C43  0.1uF  Voltage: 6.3V  [C0201]
D1  RS1G32LO4D2BDS-46IT  [RS1G32LO4D2BDS-46IT]  (parts A,B,C of 3)
R1  240R±1%  [R0402]
R2  10K±1%  [R0402]
R3  240R±1%  [R0402]
R4  0R±1%  [R0402]
R5  0R±1%  [R0402]
R6  0R±1%  [R0402]
R488  0R±1%  [R0402]

### Ports
A_DRAM_DATALINE (harness A_DRAM_DATALINE), B_DRAM_DATALINE (harness B_DRAM_DATALINE), DRAM_ADDR_CTRL_CK (harness DRAM_ADDR_CTRL_CK)

### Harnesses
A_DRAM_DATALINE: A_DRAM_DATA0, A_DRAM_DATA1, A_DRAM_DATA2, A_DRAM_DATA3, A_DRAM_DATA4, A_DRAM_DATA5, A_DRAM_DATA6, A_DRAM_DATA7, A_DRAM_DATA8, A_DRAM_DATA9, A_DRAM_DATA10, A_DRAM_DATA11, A_DRAM_DATA12, A_DRAM_DATA13, A_DRAM_DATA15, A_DRAM_DATA14, A_DRAM_DMI0, A_DRAM_DMI1, A_DRAM_DQS0_P, A_DRAM_DQS0_N, A_DRAM_DQS1_P, A_DRAM_DQS1_N
B_DRAM_DATALINE: B_DRAM_DATA0, B_DRAM_DATA1, B_DRAM_DATA2, B_DRAM_DATA3, B_DRAM_DATA4, B_DRAM_DATA5, B_DRAM_DATA6, B_DRAM_DATA7, B_DRAM_DATA8, B_DRAM_DATA9, B_DRAM_DATA10, B_DRAM_DATA11, B_DRAM_DATA12, B_DRAM_DATA13, B_DRAM_DATA15, B_DRAM_DATA14, B_DRAM_DMI1, B_DRAM_DMI0, B_DRAM_DQS0_P, B_DRAM_DQS0_N, B_DRAM_DQS1_N, B_DRAM_DQS1_P
DRAM_ADDR_CTRL_CK: B_DRAM_CKE0, B_DRAM_CKE1, B_DRAM_CLK_P, B_DRAM_CS1, A_DRAM_CLK_P, B_DRAM_CA5, A_DRAM_CLK_N, B_DRAM_CA1, B_DRAM_CLK_N, B_DRAM_CA0, B_DRAM_CA2, DRAM_RESETn, B_DRAM_CA3, A_DRAM_CKE1, A_DRAM_CS1, A_DRAM_CA3, A_DRAM_CA5, A_DRAM_CA0, A_DRAM_CS0, A_DRAM_CKE0, A_DRAM_CA4, A_DRAM_CA2, A_DRAM_CA1, B_DRAM_CA4, B_DRAM_CS0

### Nets
GND: C1.1 C2.1 C4.1 C5.1 C11.1 C12.1 C14.1 C15.1 C16.1 C18.1 C19.1 C20.1 C21.1 C22.1 C25.1 C26.1 C27.1 C28.1 C29.1 C30.1 C31.1 C33.1 C34.1 C35.1 C36.1 C37.1 C38.1 C39.1 C40.1 C41.1 C42.1 C43.1 D1.A3(VSS) D1.A10(VSS) D1.AB3(VSS) D1.AB5(VSS) D1.AB8(VSS) D1.AB10(VSS) D1.C1(VSS) D1.C5(VSS) D1.C8(VSS) D1.C12(VSS) D1.D2(VSS) D1.D4(VSS) D1.D9(VSS) D1.D11(VSS) D1.E1(VSS) D1.E5(VSS) D1.E8(VSS) D1.E12(VSS) D1.G1(VSS) D1.G3(VSS) D1.G5(VSS) D1.G8(VSS) D1.G10(VSS) D1.G12(VSS) D1.J1(VSS) D1.J3(VSS) D1.J10(VSS) D1.J12(VSS) D1.K2(VSS) D1.K4(VSS) D1.K9(VSS) D1.K11(VSS) D1.N2(VSS) D1.N4(VSS) D1.N9(VSS) D1.N11(VSS) D1.P1(VSS) D1.P3(VSS) D1.P10(VSS) D1.P12(VSS) D1.T1(VSS) D1.T3(VSS) D1.T5(VSS) D1.T8(VSS) D1.T10(VSS) D1.T12(VSS) D1.V1(VSS) D1.V5(VSS) D1.V8(VSS) D1.V12(VSS) D1.W2(VSS) D1.W4(VSS) D1.W9(VSS) D1.W11(VSS) D1.Y1(VSS) D1.Y5(VSS) D1.Y8(VSS) D1.Y12(VSS) R2.2
VCC_1V8_S3: R6.1
VDD1_1V8_DDR_S3: C1.2 C2.2 C4.2 C5.2 D1.F1(VDD1) D1.F12(VDD1) D1.G4(VDD1) D1.G9(VDD1) D1.T4(VDD1) D1.T9(VDD1) D1.U1(VDD1) D1.U12(VDD1) R6.2
VDD2_DDR_S3: C30.2 C31.2 C33.2 C34.2 C35.2 C36.2 C37.2 C38.2 C39.2 C40.2 C41.2 C42.2 C43.2 D1.A4(VDD2) D1.A9(VDD2) D1.AB4(VDD2) D1.AB9(VDD2) D1.F5(VDD2) D1.F8(VDD2) D1.G2(ODT_CA_A) D1.H1(VDD2) D1.H5(VDD2) D1.H8(VDD2) D1.H12(VDD2) D1.K1(VDD2) D1.K3(VDD2) D1.K10(VDD2) D1.K12(VDD2) D1.N1(VDD2) D1.N3(VDD2) D1.N10(VDD2) D1.N12(VDD2) D1.R1(VDD2) D1.R5(VDD2) D1.R8(VDD2) D1.R12(VDD2) D1.T2(ODT_CA_B) D1.U5(VDD2) D1.U8(VDD2) R5.1 R488.1
VDDQ_DDR_CKE_S3: R488.2
VDDQ_DDR_S0: R4.1
VDDQ_DRAM_S0: C11.2 C12.2 C14.2 C15.2 C16.2 C18.2 C19.2 C20.2 C21.2 C22.2 C25.2 C26.2 C27.2 C28.2 C29.2 D1.AA3(VDDQ) D1.AA5(VDDQ) D1.AA8(VDDQ) D1.AA10(VDDQ) D1.B3(VDDQ) D1.B5(VDDQ) D1.B8(VDDQ) D1.B10(VDDQ) D1.D1(VDDQ) D1.D5(VDDQ) D1.D8(VDDQ) D1.D12(VDDQ) D1.F3(VDDQ) D1.F10(VDDQ) D1.U3(VDDQ) D1.U10(VDDQ) D1.W1(VDDQ) D1.W5(VDDQ) D1.W8(VDDQ) D1.W12(VDDQ) R1.1 R3.1 R4.2 R5.2
A_DRAM_CA0: D1.H2(CA0_A) ; port DRAM_ADDR_CTRL_CK.A_DRAM_CA0
A_DRAM_CA1: D1.J2(CA1_A) ; port DRAM_ADDR_CTRL_CK.A_DRAM_CA1
A_DRAM_CA2: D1.H9(CA2_A) ; port DRAM_ADDR_CTRL_CK.A_DRAM_CA2
A_DRAM_CA3: D1.H10(CA3_A) ; port DRAM_ADDR_CTRL_CK.A_DRAM_CA3
A_DRAM_CA4: D1.H11(CA4_A) ; port DRAM_ADDR_CTRL_CK.A_DRAM_CA4
A_DRAM_CA5: D1.J11(CA5_A) ; port DRAM_ADDR_CTRL_CK.A_DRAM_CA5
A_DRAM_CKE0: D1.J4(CKE0_A) ; port DRAM_ADDR_CTRL_CK.A_DRAM_CKE0
A_DRAM_CKE1: D1.J5(CKE1_A) ; port DRAM_ADDR_CTRL_CK.A_DRAM_CKE1
A_DRAM_CLK_N: D1.J9(CK_C_A) ; port DRAM_ADDR_CTRL_CK.A_DRAM_CLK_N
A_DRAM_CLK_P: D1.J8(CK_T_A) ; port DRAM_ADDR_CTRL_CK.A_DRAM_CLK_P
A_DRAM_CS0: D1.H4(CS0_A) ; port DRAM_ADDR_CTRL_CK.A_DRAM_CS0
A_DRAM_CS1: D1.H3(CS1_A) ; port DRAM_ADDR_CTRL_CK.A_DRAM_CS1
A_DRAM_DATA0: D1.B2(DQ0_A) ; port A_DRAM_DATALINE.A_DRAM_DATA0
A_DRAM_DATA1: D1.C2(DQ1_A) ; port A_DRAM_DATALINE.A_DRAM_DATA1
A_DRAM_DATA2: D1.E2(DQ2_A) ; port A_DRAM_DATALINE.A_DRAM_DATA2
A_DRAM_DATA3: D1.F2(DQ3_A) ; port A_DRAM_DATALINE.A_DRAM_DATA3
A_DRAM_DATA4: D1.F4(DQ4_A) ; port A_DRAM_DATALINE.A_DRAM_DATA4
A_DRAM_DATA5: D1.E4(DQ5_A) ; port A_DRAM_DATALINE.A_DRAM_DATA5
A_DRAM_DATA6: D1.C4(DQ6_A) ; port A_DRAM_DATALINE.A_DRAM_DATA6
A_DRAM_DATA7: D1.B4(DQ7_A) ; port A_DRAM_DATALINE.A_DRAM_DATA7
A_DRAM_DATA8: D1.B11(DQ8_A) ; port A_DRAM_DATALINE.A_DRAM_DATA8
A_DRAM_DATA9: D1.C11(DQ9_A) ; port A_DRAM_DATALINE.A_DRAM_DATA9
A_DRAM_DATA10: D1.E11(DQ10_A) ; port A_DRAM_DATALINE.A_DRAM_DATA10
A_DRAM_DATA11: D1.F11(DQ11_A) ; port A_DRAM_DATALINE.A_DRAM_DATA11
A_DRAM_DATA12: D1.F9(DQ12_A) ; port A_DRAM_DATALINE.A_DRAM_DATA12
A_DRAM_DATA13: D1.E9(DQ13_A) ; port A_DRAM_DATALINE.A_DRAM_DATA13
A_DRAM_DATA14: D1.C9(DQ14_A) ; port A_DRAM_DATALINE.A_DRAM_DATA14
A_DRAM_DATA15: D1.B9(DQ15_A) ; port A_DRAM_DATALINE.A_DRAM_DATA15
A_DRAM_DMI0: D1.C3(DMI0_A) ; port A_DRAM_DATALINE.A_DRAM_DMI0  [project net A_DRAM_DATALINE.A_DRAM_DMI0]
A_DRAM_DMI1: D1.C10(DMI1_A) ; port A_DRAM_DATALINE.A_DRAM_DMI1  [project net A_DRAM_DATALINE.A_DRAM_DMI1]
A_DRAM_DQS0_N: D1.E3(DQS0_C_A) ; port A_DRAM_DATALINE.A_DRAM_DQS0_N  [project net A_DRAM_DATALINE.A_DRAM_DQS0_N]
A_DRAM_DQS0_P: D1.D3(DQS0_T_A) ; port A_DRAM_DATALINE.A_DRAM_DQS0_P  [project net A_DRAM_DATALINE.A_DRAM_DQS0_P]
A_DRAM_DQS1_N: D1.E10(DQS1_C_A) ; port A_DRAM_DATALINE.A_DRAM_DQS1_N  [project net A_DRAM_DATALINE.A_DRAM_DQS1_N]
A_DRAM_DQS1_P: D1.D10(DQS1_T_A) ; port A_DRAM_DATALINE.A_DRAM_DQS1_P  [project net A_DRAM_DATALINE.A_DRAM_DQS1_P]
B_DRAM_CA0: D1.R2(CA0_B) ; port DRAM_ADDR_CTRL_CK.B_DRAM_CA0
B_DRAM_CA1: D1.P2(CA1_B) ; port DRAM_ADDR_CTRL_CK.B_DRAM_CA1
B_DRAM_CA2: D1.R9(CA2_B) ; port DRAM_ADDR_CTRL_CK.B_DRAM_CA2
B_DRAM_CA3: D1.R10(CA3_B) ; port DRAM_ADDR_CTRL_CK.B_DRAM_CA3
B_DRAM_CA4: D1.R11(CA4_B) ; port DRAM_ADDR_CTRL_CK.B_DRAM_CA4
B_DRAM_CA5: D1.P11(CA5_B) ; port DRAM_ADDR_CTRL_CK.B_DRAM_CA5
B_DRAM_CKE0: D1.P4(CKE0_B) ; port DRAM_ADDR_CTRL_CK.B_DRAM_CKE0
B_DRAM_CKE1: D1.P5(CKE1_B) ; port DRAM_ADDR_CTRL_CK.B_DRAM_CKE1
B_DRAM_CLK_N: D1.P9(CK_C_B) ; port DRAM_ADDR_CTRL_CK.B_DRAM_CLK_N
B_DRAM_CLK_P: D1.P8(CK_T_B) ; port DRAM_ADDR_CTRL_CK.B_DRAM_CLK_P
B_DRAM_CS0: D1.R4(CS0_B) ; port DRAM_ADDR_CTRL_CK.B_DRAM_CS0
B_DRAM_CS1: D1.R3(CS1_B) ; port DRAM_ADDR_CTRL_CK.B_DRAM_CS1
B_DRAM_DATA0: D1.AA2(DQ0_B) ; port B_DRAM_DATALINE.B_DRAM_DATA0
B_DRAM_DATA1: D1.Y2(DQ1_B) ; port B_DRAM_DATALINE.B_DRAM_DATA1
B_DRAM_DATA2: D1.V2(DQ2_B) ; port B_DRAM_DATALINE.B_DRAM_DATA2
B_DRAM_DATA3: D1.U2(DQ3_B) ; port B_DRAM_DATALINE.B_DRAM_DATA3
B_DRAM_DATA4: D1.U4(DQ4_B) ; port B_DRAM_DATALINE.B_DRAM_DATA4
B_DRAM_DATA5: D1.V4(DQ5_B) ; port B_DRAM_DATALINE.B_DRAM_DATA5
B_DRAM_DATA6: D1.Y4(DQ6_B) ; port B_DRAM_DATALINE.B_DRAM_DATA6
B_DRAM_DATA7: D1.AA4(DQ7_B) ; port B_DRAM_DATALINE.B_DRAM_DATA7
B_DRAM_DATA8: D1.AA11(DQ8_B) ; port B_DRAM_DATALINE.B_DRAM_DATA8
B_DRAM_DATA9: D1.Y11(DQ9_B) ; port B_DRAM_DATALINE.B_DRAM_DATA9
B_DRAM_DATA10: D1.V11(DQ10_B) ; port B_DRAM_DATALINE.B_DRAM_DATA10
B_DRAM_DATA11: D1.U11(DQ11_B) ; port B_DRAM_DATALINE.B_DRAM_DATA11
B_DRAM_DATA12: D1.U9(DQ12_B) ; port B_DRAM_DATALINE.B_DRAM_DATA12
B_DRAM_DATA13: D1.V9(DQ13_B) ; port B_DRAM_DATALINE.B_DRAM_DATA13
B_DRAM_DATA14: D1.Y9(DQ14_B) ; port B_DRAM_DATALINE.B_DRAM_DATA14
B_DRAM_DATA15: D1.AA9(DQ15_B) ; port B_DRAM_DATALINE.B_DRAM_DATA15
B_DRAM_DMI0: D1.Y3(DMI0_B) ; port B_DRAM_DATALINE.B_DRAM_DMI0  [project net B_DRAM_DATALINE.B_DRAM_DMI0]
B_DRAM_DMI1: D1.Y10(DMI1_B) ; port B_DRAM_DATALINE.B_DRAM_DMI1  [project net B_DRAM_DATALINE.B_DRAM_DMI1]
B_DRAM_DQS0_N: D1.V3(DQS0_C_B) ; port B_DRAM_DATALINE.B_DRAM_DQS0_N  [project net B_DRAM_DATALINE.B_DRAM_DQS0_N]
B_DRAM_DQS0_P: D1.W3(DQS0_T_B) ; port B_DRAM_DATALINE.B_DRAM_DQS0_P  [project net B_DRAM_DATALINE.B_DRAM_DQS0_P]
B_DRAM_DQS1_N: D1.V10(DQS1_C_B) ; port B_DRAM_DATALINE.B_DRAM_DQS1_N  [project net B_DRAM_DATALINE.B_DRAM_DQS1_N]
B_DRAM_DQS1_P: D1.W10(DQS1_T_B) ; port B_DRAM_DATALINE.B_DRAM_DQS1_P  [project net B_DRAM_DATALINE.B_DRAM_DQS1_P]
DRAM_RESETn: D1.T11(RESET_N) R2.1 ; port DRAM_ADDR_CTRL_CK.DRAM_RESETn  [project net DRAM_ADDR_CTRL_CK.DRAM_RESETn]
NetD1_A5: D1.A5(ZQ0) R1.2
NetD1_A8: D1.A8(ZQ1) R3.2

Not connected (* = marked no-connect by the designer): D1 A1(DNU)* A2(DNU)* A11(DNU)* A12(DNU)* AA1(DNU)* AA12(DNU)* AB1(DNU)* AB2(DNU)* AB11(DNU)* AB12(DNU)* B1(DNU)* B12(DNU)* G11(NC)* K5(NC)* K8(NC)* N5(NC)* N8(NC)*

### Layout directives
net class DRAM_STROBE_0: A_DRAM_DATA0, A_DRAM_DATA1, A_DRAM_DATA2, A_DRAM_DATA3, A_DRAM_DATA4, A_DRAM_DATA5, A_DRAM_DATA6, A_DRAM_DATA7, A_DRAM_DATA8, A_DRAM_DATA9, A_DRAM_DATA10, A_DRAM_DATA11, A_DRAM_DATA12, A_DRAM_DATA13, A_DRAM_DATA14, A_DRAM_DATA15, A_DRAM_DMI0, A_DRAM_DMI1
net class DRAM_STROBE_1: B_DRAM_DATA0, B_DRAM_DATA1, B_DRAM_DATA2, B_DRAM_DATA3, B_DRAM_DATA4, B_DRAM_DATA5, B_DRAM_DATA6, B_DRAM_DATA7, B_DRAM_DATA8, B_DRAM_DATA9, B_DRAM_DATA10, B_DRAM_DATA11, B_DRAM_DATA12, B_DRAM_DATA13, B_DRAM_DATA14, B_DRAM_DATA15, B_DRAM_DMI0, B_DRAM_DMI1
net class DRAM_CA_B: B_DRAM_CA0, B_DRAM_CA1, B_DRAM_CA2, B_DRAM_CA3, B_DRAM_CA4, B_DRAM_CA5, B_DRAM_CKE0, B_DRAM_CKE1, B_DRAM_CS0, B_DRAM_CS1
differential pair; differential pair class A_DRAM_CLK: A_DRAM_CLK_P
differential pair; differential pair class B_DRAM_CLK: B_DRAM_CLK_P
differential pair: A_DRAM_CLK_N, A_DRAM_DATALINE.A_DRAM_DQS0_N, A_DRAM_DATALINE.A_DRAM_DQS1_N, B_DRAM_CLK_N, B_DRAM_DATALINE.B_DRAM_DQS0_N, B_DRAM_DATALINE.B_DRAM_DQS1_N
differential pair; differential pair class DRAM_STROBE0_B_Diff: B_DRAM_DATALINE.B_DRAM_DQS0_P
differential pair; differential pair class DRAM_STROBE1_B_Diff: B_DRAM_DATALINE.B_DRAM_DQS1_P
differential pair; differential pair class DRAM_STROBE0_A_Diff: A_DRAM_DATALINE.A_DRAM_DQS0_P
differential pair; differential pair class DRAM_STROBE1_A_Diff: A_DRAM_DATALINE.A_DRAM_DQS1_P
net class DRAM_CA_A: A_DRAM_CA0, A_DRAM_CA1, A_DRAM_CA2, A_DRAM_CA3, A_DRAM_CA4, A_DRAM_CA5, A_DRAM_CKE0, A_DRAM_CKE1, A_DRAM_CS0, A_DRAM_CS1

### Notes on the sheet
- LPDDR4
- Connection to CPU_LPDDR4
- (near R5) DNP
- Подп. и дата
- Инв. № дубл.
- Взам. инв. №
- Инв. № подл.
- Изм.
- Лист
- № докум.
- Подп.
- Дата
- Копировал
- Формат А3
- (in symbol RS1G32LO4D2BDS-46IT, part A) LPDDR4
- (in symbol RS1G32LO4D2BDS-46IT, part B) LPDDR4
- (in symbol RS1G32LO4D2BDS-46IT, part C) LPDDR4

### Library data of the parts
C1 C2 C4 C16 C18-C22 C25-C29 C35-C43 = 0201-X5R-6.3V-0.1uF±10%: as C260-C264 on sheet CPU_GPIO; Case: C0201; Part Number: 0201-X5R-6.3V-0.1uF±10%; Value: 0.1uF; Temperature: -55°C~85°C; ComponentLink2Description: Link to datasheet; ComponentLink1Description: DATASHEET; ComponentLink2URL: https://www.terraelectronica.ru/product/1020032; ComponentLink1URL: Datasheets/capacitors/UPY-GPHC_X5R_4V-to-50V_27.pdf; Last changed: 27.10.2022
C5 C14 C15 C33 C34 = 0201-X5R-6.3V-1uF±20%: as C254-C259 on sheet CPU_GPIO; Case: C0201; Part Number: 0201-X5R-6.3V-1uF±20%; Value: 1uF; Temperature: -55°C~85°C; ComponentLink2Description: Link to datasheet; ComponentLink1Description: DATASHEET; ComponentLink2URL: https://www.terraelectronica.ru/product/1209278; ComponentLink1URL: Datasheets/capacitors/GRM033R60J105MEA2-61A.pdf; Last changed: 27.10.2022
C11 C12 C30 C31 = 0402-X5R-6.3V-10uF±20%: Manufacturer: Yageo; NameFromManufacturer: CC0402MRX5R5BB106; Dielectric: X5R; Place: *); Tolerance: 20%; Check: False; Case: C0402; Part Number: 0402-X5R-6.3V-10uF±20%; Value: 10uF; Temperature: -55°C~125°C; ComponentLink2Description: Link to datasheet; ComponentLink1Description: DATASHEET; ComponentLink2URL: https://ru.mouser.com/ProductDetail/YAGEO/CC0402MRX5R5BB106?qs=%2Fha2pyFadujQAk9rG2cgJj8l7IbODD3KVaDjvxAcKzu9LtlLnRlq6Q%3D%3D; ComponentLink1URL: Datasheets/capacitors/UPY-GPHC_X5R_4V-to-50V_27.pdf; Last changed: 27.10.2022
D1 = RS1G32LO4D2BDS-46IT: DDR4 SDRAM емкостью 32 Гбит с организацией 1024М x 32 бит; Manufacturer: Rayson; Check: False; Part Number: RS1G32LO4D2BDS-46IT; NameFromManufacturer: RS1G32LO4D2BDS-46IT; Value: RS1G32LO4D2BDS-46IT
R1 R3 = 0402-0.0625W-240R-100ppm±1%: NameFromManufacturer: RC0402FR-07240RL; Manufacturer: Yageo; Place: *); Value: 240R; Tolerance: 1%; Check: False; Case: R0402; Part Number: 0402-0.0625W-240R-100ppm±1%; Temperature: -55°C~155°C; ComponentLink1Description: DATASHEET; ComponentLink1URL: https://www.terraelectronica.ru/product/870661; Datasheet: Datasheets/resistors/PYu-RC_Group_51_RoHS_L_11.pdf; Last changed: 27.10.2022
R2 = 0402-0.0625W-10K-100ppm±1%: Chip Resistor 0402 10kΩ ±1% 50V ±100ppm/℃ Thick Film; NameFromManufacturer: RC0402FR-0710KL; Manufacturer: Yageo; Place: *); Value: 10K; Check: False; Case: R0402; Part Number: 0402-0.0625W-10K-100ppm±1%; Tolerance: 1%; Temperature: -55°C~155°C; ComponentLink1Description: DATASHEET; ComponentLink1URL: https://ru.mouser.com/ProductDetail/YAGEO/RC0402FR-0710KL?qs=%2Fha2pyFaduhjtLcYvKXQ8IogF7YwN7YtH%252BOO8ZtEEMnoa4yoWYcwpw%3D%3D; Datasheet: Datasheets/resistors/PYu-RC_Group_51_RoHS_L_11.pdf; Last changed: 27.10.2022
R4-R6 R488 = 0402-0.0625W-0R-100ppm±1%: as R238 on sheet CPU_GPIO; Case: R0402; Part Number: 0402-0.0625W-0R-100ppm±1%; Tolerance: 1%; Temperature: -55°C~155°C; ComponentLink1Description: DATASHEET; ComponentLink1URL: https://www.chipdip.ru/product0/8000617426?ysclid=l7og5x0plo427794326; Datasheet: Datasheets/resistors/DOC012445956.pdf; Last changed: 27.10.2022

## Sheet Flash_eMMC_MicroSD.SchDoc
size 420 x 297 mm; Scale: 1:1; DocumentType: Схема электрическая принципиальная; SheetNumber: 14; SheetTotal: 32; DocumentTypeShort: Э3; DocumentInvertoryNumber: ㅤ
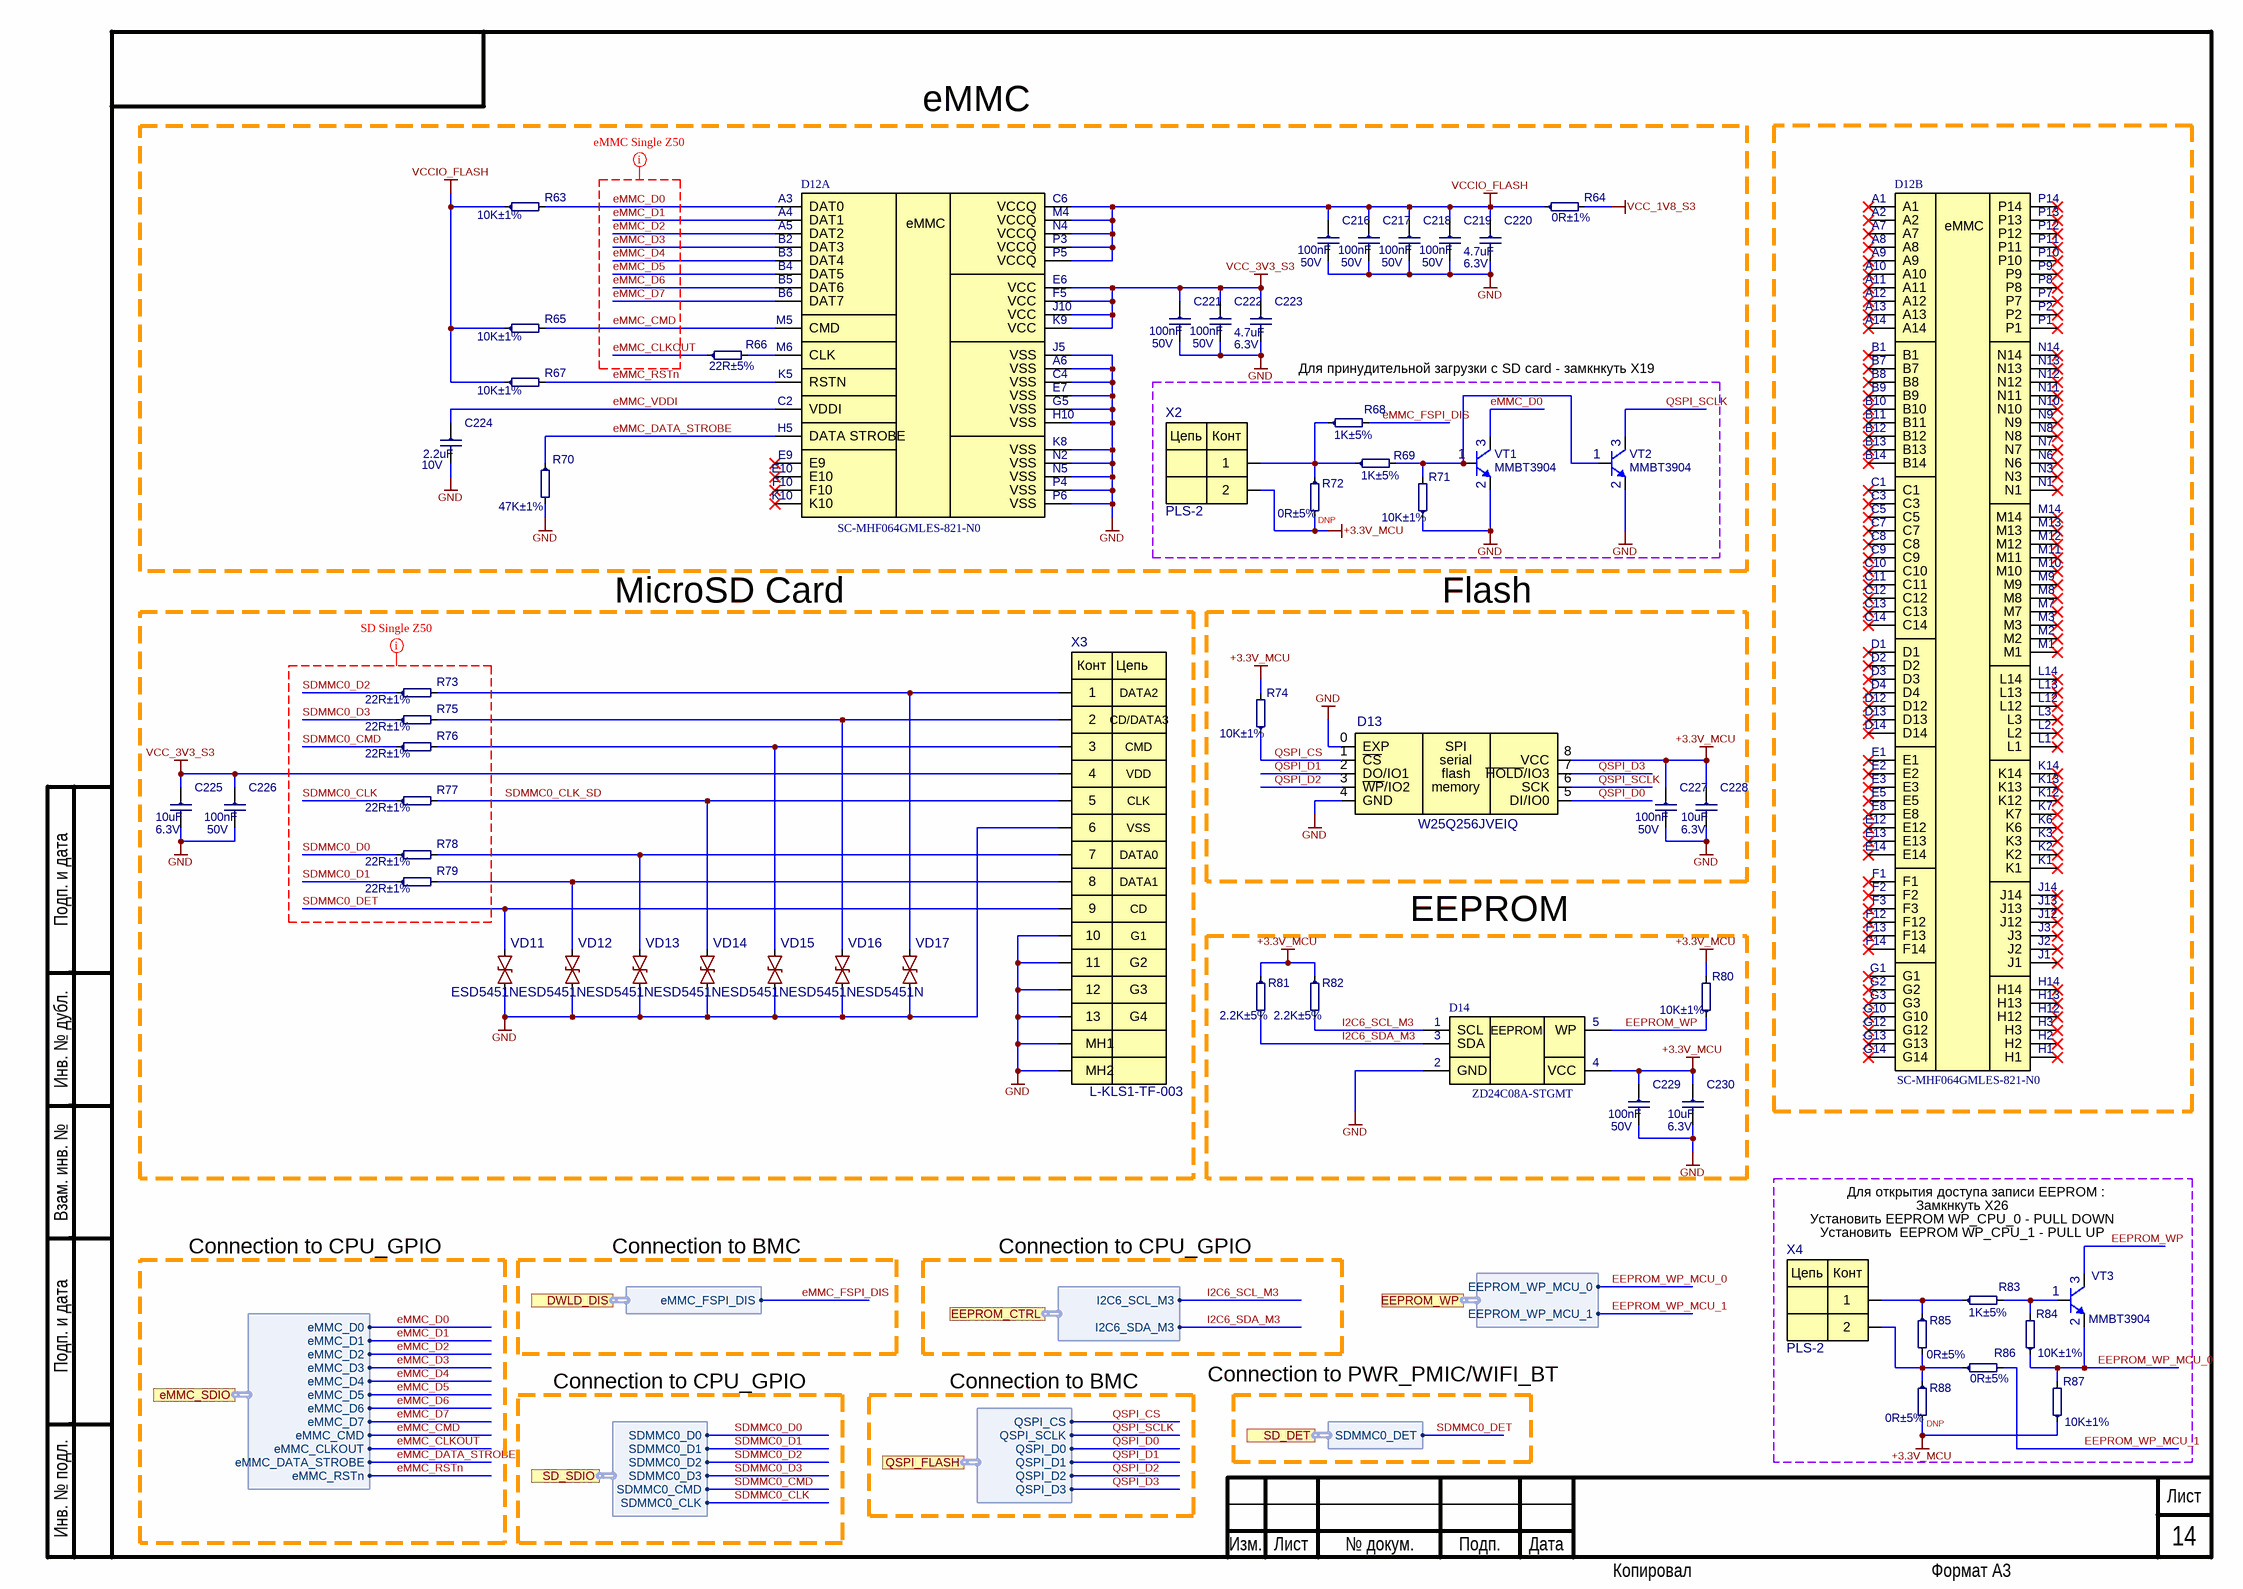
[diagram p13: Flash_eMMC_MicroSD.SchDoc]

### Parts
C216  100nF  Voltage: 50V  [C0402]
C217  100nF  Voltage: 50V  [C0402]
C218  100nF  Voltage: 50V  [C0402]
C219  100nF  Voltage: 50V  [C0402]
C220  4.7uF  Voltage: 6.3V  [C0402]
C221  100nF  Voltage: 50V  [C0402]
C222  100nF  Voltage: 50V  [C0402]
C223  4.7uF  Voltage: 6.3V  [C0402]
C224  2.2uF  Voltage: 10V  [C0402]
C225  10uF  Voltage: 6.3V  [C0402]
C226  100nF  Voltage: 50V  [C0402]
C227  100nF  Voltage: 50V  [C0402]
C228  10uF  Voltage: 6.3V  [C0402]
C229  100nF  Voltage: 50V  [C0402]
C230  10uF  Voltage: 6.3V  [C0402]
D12  SC-MHF064GMLES-821-N0  [SC-MHF064GMLES-821-N0]  (parts A,B of 2)
D13  W25Q256JVEIQ  [WSON-8-8x6]
D14  ZD24C08A-STGMT  [ZD24C08A-STGMT]
R63  10K±1%  [R0402]
R64  0R±1%  [R0603]
R65  10K±1%  [R0402]
R66  22R±5%  [R0402]
R67  10K±1%  [R0402]
R68  1K±5%  [R0402]
R69  1K±5%  [R0402]
R70  47K±1%  [R0402]
R71  10K±1%  [R0402]
R72  0R±5%  [R0402]
R73  22R±1%  [R0402]
R74  10K±1%  [R0402]
R75  22R±1%  [R0402]
R76  22R±1%  [R0402]
R77  22R±1%  [R0402]
R78  22R±1%  [R0402]
R79  22R±1%  [R0402]
R80  10K±1%  [R0402]
R81  2.2K±5%  [R0402]
R82  2.2K±5%  [R0402]
R83  1K±5%  [R0402]
R84  10K±1%  [R0402]
R85  0R±5%  [R0402]
R86  0R±5%  [R0402]
R87  10K±1%  [R0402]
R88  0R±5%  [R0402]
VD11  ESD5451N  [DFN_1006_2]
VD12  ESD5451N  [DFN_1006_2]
VD13  ESD5451N  [DFN_1006_2]
VD14  ESD5451N  [DFN_1006_2]
VD15  ESD5451N  [DFN_1006_2]
VD16  ESD5451N  [DFN_1006_2]
VD17  ESD5451N  [DFN_1006_2]
VT1  MMBT3904  [SOT23]
VT2  MMBT3904  [SOT23]
VT3  MMBT3904  [SOT23]
X2  PLS-2  [PLS2]
X3  L-KLS1-TF-003  [KLS1-TF-003]
X4  PLS-2  [PLS2]

### Blocks framed on the sheet
Для принудительной загрузки с SD card - замкнкуть X19: R68 R69 R71 R72 VT1 VT2 X2

### Ports
DWLD_DIS (harness DWLD_DIS), EEPROM_CTRL (harness EEPROM_CTRL), EEPROM_WP (harness EEPROM_WP), eMMC_SDIO (harness eMMC_SDIO), QSPI_FLASH (harness QSPI_FLASH), SD_DET (harness SD_DET), SD_SDIO (harness SD_SDIO)

### Harnesses
eMMC_SDIO: eMMC_D0, eMMC_D1, eMMC_D2, eMMC_D3, eMMC_D4, eMMC_D5, eMMC_D6, eMMC_D7, eMMC_CMD, eMMC_CLKOUT, eMMC_DATA_STROBE, eMMC_RSTn
SD_SDIO: SDMMC0_D0, SDMMC0_D1, SDMMC0_D2, SDMMC0_D3, SDMMC0_CMD, SDMMC0_CLK
DWLD_DIS: eMMC_FSPI_DIS
SD_DET: SDMMC0_DET
QSPI_FLASH: QSPI_CS, QSPI_SCLK, QSPI_D0, QSPI_D1, QSPI_D2, QSPI_D3
EEPROM_WP: EEPROM_WP_MCU_0, EEPROM_WP_MCU_1
EEPROM_CTRL: I2C6_SCL_M3, I2C6_SDA_M3

### Nets
+3.3V_MCU: C227.1 C228.1 C229.1 C230.1 D13.8(VCC) D14.4(VCC) R72.2 R74.2 R80.2 R81.1 R82.1 R87.1 R88.2 X2.2
GND: C216.2 C217.2 C218.2 C219.2 C220.2 C221.2 C222.2 C223.2 C224.2 C225.2 C226.2 C227.2 C228.2 C229.2 C230.2 D12.A6(VSS) D12.C4(VSS) D12.E7(VSS) D12.G5(VSS) D12.H10(VSS) D12.J5(VSS) D12.K8(VSS) D12.N2(VSS) D12.N5(VSS) D12.P4(VSS) D12.P6(VSS) D13.0(EXP) D13.4(GND) D14.2(GND) R70.2 R71.1 VD11.2 VD12.2 VD13.2 VD14.2 VD15.2 VD16.2 VD17.2 VT1.2(E) VT2.2(E) X3.6 X3.10 X3.11 X3.12 X3.13 X3.MH1 X3.MH2
VCC_1V8_S3: R64.2
VCC_3V3_S3: C221.1 C222.1 C223.1 C225.1 C226.1 D12.E6(VCC) D12.F5(VCC) D12.J10(VCC) D12.K9(VCC) X3.4
VCCIO_FLASH: C216.1 C217.1 C218.1 C219.1 C220.1 D12.C6(VCCQ) D12.M4(VCCQ) D12.N4(VCCQ) D12.P3(VCCQ) D12.P5(VCCQ) R63.1 R64.1 R65.1 R67.1
EEPROM_WP: D14.5(WP) R80.1 VT3.3(C)
EEPROM_WP_MCU_0: R84.1 R87.2 VT3.2(E) ; port EEPROM_WP.EEPROM_WP_MCU_0  [project net EEPROM_WP.EEPROM_WP_MCU_0]
EEPROM_WP_MCU_1: R86.2 ; port EEPROM_WP.EEPROM_WP_MCU_1  [project net EEPROM_WP.EEPROM_WP_MCU_1]
eMMC_CLKOUT: R66.1 ; port eMMC_SDIO.eMMC_CLKOUT
eMMC_CMD: D12.M5(CMD) R65.2 ; port eMMC_SDIO.eMMC_CMD
eMMC_D0: D12.A3(DAT0) R63.2 VT1.3(C) ; port eMMC_SDIO.eMMC_D0
eMMC_D1: D12.A4(DAT1) ; port eMMC_SDIO.eMMC_D1
eMMC_D2: D12.A5(DAT2) ; port eMMC_SDIO.eMMC_D2
eMMC_D3: D12.B2(DAT3) ; port eMMC_SDIO.eMMC_D3
eMMC_D4: D12.B3(DAT4) ; port eMMC_SDIO.eMMC_D4
eMMC_D5: D12.B4(DAT5) ; port eMMC_SDIO.eMMC_D5
eMMC_D6: D12.B5(DAT6) ; port eMMC_SDIO.eMMC_D6
eMMC_D7: D12.B6(DAT7) ; port eMMC_SDIO.eMMC_D7
eMMC_DATA_STROBE: D12.H5(DATA_STROBE) R70.1 ; port eMMC_SDIO.eMMC_DATA_STROBE
eMMC_FSPI_DIS: R68.2 ; port DWLD_DIS.eMMC_FSPI_DIS  [project net DWLD_DIS.eMMC_FSPI_DIS]
eMMC_RSTn: D12.K5(RSTN) R67.2 ; port eMMC_SDIO.eMMC_RSTn
eMMC_VDDI: C224.1 D12.C2(VDDI)
I2C6_SCL_M3: D14.1(SCL) R82.2 ; port EEPROM_CTRL.I2C6_SCL_M3  [project net EEPROM_CTRL.I2C6_SCL_M3]
I2C6_SDA_M3: D14.3(SDA) R81.2 ; port EEPROM_CTRL.I2C6_SDA_M3  [project net EEPROM_CTRL.I2C6_SDA_M3]
QSPI_CS: D13.1(~{CS}) R74.1 ; port QSPI_FLASH.QSPI_CS
QSPI_D0: D13.5(DI/IO0) ; port QSPI_FLASH.QSPI_D0
QSPI_D1: D13.2(DO/IO1) ; port QSPI_FLASH.QSPI_D1
QSPI_D2: D13.3(~{WP}/IO2) ; port QSPI_FLASH.QSPI_D2
QSPI_D3: D13.7(~{HOLD}/IO3) ; port QSPI_FLASH.QSPI_D3
QSPI_SCLK: D13.6(SCK) VT2.3(C) ; port QSPI_FLASH.QSPI_SCLK  [project net QSPI_FLASH.QSPI_SCLK]
SDMMC0_CLK: R77.1 ; port SD_SDIO.SDMMC0_CLK  [project net SD_SDIO.SDMMC0_CLK]
SDMMC0_CLK_SD: R77.2 VD14.1 X3.5
SDMMC0_CMD: R76.1 ; port SD_SDIO.SDMMC0_CMD  [project net SD_SDIO.SDMMC0_CMD]
SDMMC0_D0: R78.1 ; port SD_SDIO.SDMMC0_D0  [project net SD_SDIO.SDMMC0_D0]
SDMMC0_D1: R79.1 ; port SD_SDIO.SDMMC0_D1  [project net SD_SDIO.SDMMC0_D1]
SDMMC0_D2: R73.1 ; port SD_SDIO.SDMMC0_D2  [project net SD_SDIO.SDMMC0_D2]
SDMMC0_D3: R75.1 ; port SD_SDIO.SDMMC0_D3  [project net SD_SDIO.SDMMC0_D3]
SDMMC0_DET: VD11.1 X3.9 ; port SD_DET.SDMMC0_DET  [project net SD_DET.SDMMC0_DET]
NetD12_M6: D12.M6(CLK) R66.2
NetR68_1: R68.1 R69.1 R72.1 X2.1
NetR69_2: R69.2 R71.2 VT1.1(B) VT2.1(B)
NetR73_2: R73.2 VD17.1 X3.1
NetR75_2: R75.2 VD16.1 X3.2
NetR76_2: R76.2 VD15.1 X3.3
NetR78_2: R78.2 VD13.1 X3.7
NetR79_2: R79.2 VD12.1 X3.8
NetR83_1: R83.1 R85.1 X4.1
NetR83_2: R83.2 R84.2 VT3.1(B)
NetR85_2: R85.2 R86.1 R88.1 X4.2

Not connected (* = marked no-connect by the designer): D12 A1* A2* A7* A8* A9* A10* A11* A12* A13* A14* B1* B7* B8* B9* B10* B11* B12* B13* B14* C1* C3* C5* C7* C8* C9* C10* C11* C12* C13* C14* D1* D2* D3* D4* D12* D13* D14* E1* E2* E3* E5* E8* E9* E10* E12* E13* E14* F1* F2* F3* F10* F12* F13* F14* G1* G2* G3* G10* G12* G13* G14* H1* H2* H3* H12* H13* H14* J1* J2* J3* J12* J13* J14* K1* K2* K3* K6* K7* K10* K12* K13* K14* L1* L2* L3* L12* L13* L14* M1* M2* M3* M7* M8* M9* M10* M11* M12* M13* M14* N1* N3* N6* N7* N8* N9* N10* N11* N12* N13* N14* P1* P2* P7* P8* P9* P10* P11* P12* P13* P14*

### Layout directives
net class eMMC: eMMC_CLKOUT, eMMC_CMD, eMMC_D0, eMMC_D1, eMMC_D2, eMMC_D3, eMMC_D4, eMMC_D5, eMMC_D6, eMMC_D7
net class SD: SDMMC0_CLK, SDMMC0_CMD, SDMMC0_D0, SDMMC0_D1, SDMMC0_D2, SDMMC0_D3, SDMMC0_DET

### Notes on the sheet
- eMMC
- (near R72) DNP
- MicroSD Card
- Flash
- EEPROM
- Замкнкуть X26
- Для открытия доступа записи EEPROM :
- Connection to CPU_GPIO
- Connection to BMC
- Установить EEPROM WP_CPU_0 - PULL DOWN
- Установить  EEPROM WP_CPU_1 - PULL UP
- Connection to PWR_PMIC/WIFI_BT
- (near R88) DNP
- Подп. и дата
- Инв. № дубл.
- Взам. инв. №
- Инв. № подл.
- Изм.
- Лист
- № докум.
- Подп.
- Дата
- Копировал
- Формат А3
- (in symbol L-KLS1-TF-003) Конт; Цепь; DATA2; CD/DATA3; CMD; VDD; CLK; VSS; DATA0; DATA1; CD; G1; G2; G3; G4
- (in symbol PLS-2) Цепь; Конт
- (in symbol SC-MHF064GMLES-821-N0, part A) eMMC
- (in symbol SC-MHF064GMLES-821-N0, part B) eMMC
- (in symbol W25Q512JVEIQ) SPI; serial; flash; memory
- (in symbol ZD24C08A-STGMT) EEPROM

### Library data of the parts
C216-C219 C221 C222 C226 C227 C229 = 0402-X7R-50V-0.1uF±10%: Ceramic Capacitor 0402 100nF ±10% 50V X7R; Manufacturer: Yageo; NameFromManufacturer: CC0402KRX7R9BB104; Place: *); Check: False; Dielectric: X7R; Case: C0402; Part Number: 0402-X7R-50V-0.1uF±10%; Value: 100nF; Tolerance: 10%; Temperature: -55°C~125°C; ComponentLink2Description: Link to datasheet; ComponentLink1Description: DATASHEET; ComponentLink2URL: https://www.lcsc.com/product-detail/Multilayer-Ceramic-Capacitors-MLCC-SMD-SMT_YAGEO-CC0402KRX7R9BB104_C131394.html; Last changed: 09.04.2025
C220 C223 = 0402-X5R-6.3V-4.7uF±20%: Ceramic Capacitor 0402 4.7uF ±20% 6.3V X5R; Manufacturer: Yageo; NameFromManufacturer: CC0402MRX5R5BB475; Place: *); Check: False; Dielectric: X5R; Case: C0402; Part Number: 0402-X5R-6.3V-4.7uF±20%; Value: 4.7uF; Tolerance: 20%; Temperature: -55°C~125°C; ComponentLink2Description: Link to datasheet; ComponentLink1Description: DATASHEET; ComponentLink2URL: https://ru.mouser.com/ProductDetail/YAGEO/CC0402MRX5R5BB475?qs=%2Fha2pyFadujQAk9rG2cgJpeZ0BKEEZe0MyMZqMwsns5cG502XdwDVw%3D%3D; ComponentLink1URL: Datasheets/capacitors/UPY-GPHC_X5R_4V-to-50V_27.pdf; Last changed: 27.10.2022
C224 = 0402-X5R-10V-2.2uF±10%: *; Manufacturer: Yageo; NameFromManufacturer: CC0402KRX5R6BB225; Dielectric: X5R; Place: *); Tolerance: 10%; Check: False; Case: C0402; Part Number: 0402-X5R-10V-2.2uF±10%; Value: 2.2uF; Temperature: -55°C~85°C; ComponentLink2Description: Link to datasheet; ComponentLink1Description: DATASHEET; ComponentLink2URL: https://ru.mouser.com/ProductDetail/YAGEO/CC0402KRX5R6BB225?qs=%2Fha2pyFadujgDGyIaqGI8bfvbfiNNcC7p03y2QorR%252BZcRhliH8dUqw%3D%3D; ComponentLink1URL: Datasheets/capacitors/UPY-GPHC_X5R_4V-to-50V_27.pdf; Last changed: 27.10.2022
C225 C228 C230 = 0402-X5R-6.3V-10uF±20%: as C11 on sheet IC_LPDDR4; Case: C0402; Part Number: 0402-X5R-6.3V-10uF±20%; Value: 10uF; Temperature: -55°C~125°C; ComponentLink2Description: Link to datasheet; ComponentLink1Description: DATASHEET; ComponentLink2URL: https://ru.mouser.com/ProductDetail/YAGEO/CC0402MRX5R5BB106?qs=%2Fha2pyFadujQAk9rG2cgJj8l7IbODD3KVaDjvxAcKzu9LtlLnRlq6Q%3D%3D; ComponentLink1URL: Datasheets/capacitors/UPY-GPHC_X5R_4V-to-50V_27.pdf; Last changed: 27.10.2022
D12 = SC-MHF064GMLES-821-N0: Flash Card 64G-bytes 1.8V/3.3V Embedded MMC 153-Pin FBGA; Manufacturer: Samsung; Analog: KLM8G1GETF-B041; Check: False; Part Number: SC-MHF064GMLES-821-N0; NameFromManufacturer: SC-MHF064GMLES-821-N0; Value: SC-MHF064GMLES-821-N0; ComponentLink1Description: DATASHEET; Last changed: 24.03.2023
D13 = W25Q512JVEIQ: 3V 256M-BIT SERIAL FLASH MEMORY WITH DUAL/QUAD SPI; Manufacturer: Winbond; Place: *); Check: False; Part Number: W25Q256JVEIQ; Temperature: -40°C~85°C; Value: W25Q256JVEIQ; ComponentLink1Description: DATASHEET; NameFromManufacturer: W25Q256JVEIQ; ComponentLink1URL: https://www.digikey.com/en/products/detail/winbond-electronics/W25Q512JVEIQ/10244706; Datasheet: Datasheets/ic/W25Q512JV_SPI_RevF_09032021Plus.pdf; Last changed: 27.10.2022
D14 = ZD24C08A-STGMT: 8Kbit 1MHz I2C SOT-23-5 EEPROM; Manufacturer: Zetta; Check: False; Part Number: ZD24C08A-STGMT; NameFromManufacturer: ZD24C08A-STGMT; Value: ZD24C08A-STGMT
R63 R65 R67 R71 R74 R80 R84 R87 = 0402-0.0625W-10K-100ppm±1%: as R2 on sheet IC_LPDDR4; Case: R0402; Part Number: 0402-0.0625W-10K-100ppm±1%; Tolerance: 1%; Temperature: -55°C~155°C; ComponentLink1Description: DATASHEET; ComponentLink1URL: https://ru.mouser.com/ProductDetail/YAGEO/RC0402FR-0710KL?qs=%2Fha2pyFaduhjtLcYvKXQ8IogF7YwN7YtH%252BOO8ZtEEMnoa4yoWYcwpw%3D%3D; Datasheet: Datasheets/resistors/PYu-RC_Group_51_RoHS_L_11.pdf; Last changed: 27.10.2022
R64 = 0603-0.1W-0R-200ppm±1%: NameFromManufacturer: RC0603FR-070RL; Manufacturer: Yageo; Place: *); Value: 0R; Tolerance: 1%; Check: False; Case: R0603; Part Number: 0603-0.1W-0R-200ppm±1%; Temperature: -55°C~155°C; ComponentLink1Description: DATASHEET; ComponentLink1URL: https://www.yageo.com/upload/media/product/productsearch/datasheet/rchip/PYu-RC_Group_51_RoHS_L_11.pdf; Datasheet: Datasheets/resistors/PYu-RC_Group_51_RoHS_L_11.pdf; Last changed: 27.10.2022
R66 = 0402-0.0625W-22R-100ppm±5%: as R122 on sheet CPU_GPIO; Case: R0402; Part Number: 0402-0.0625W-22R-100ppm±5%; Temperature: -55°C~155°C; ComponentLink1Description: DATASHEET; ComponentLink1URL: https://www.terraelectronica.ru/pdf/show?pdf_file=%252Fds%252Fpdf%252FR%252FRC0402.pdf; Datasheet: Datasheets/resistors/PYu-RC_Group_51_RoHS_L_12.pdf; Last changed: 27.10.2022
R68 R69 R83 = 0402-0.0625W-1K-100ppm±5%: NameFromManufacturer: RC0402JR-071KL; Manufacturer: Yageo; Place: *); Value: 1K; Tolerance: 5%; Check: False; Case: R0402; Part Number: 0402-0.0625W-1K-100ppm±5%; Temperature: -55°C~155°C; ComponentLink1Description: DATASHEET; ComponentLink1URL: https://ru.mouser.com/ProductDetail/YAGEO/RC0402JR-071KL?qs=%2Fha2pyFadugNN0LzwXn2qBG%2Fxv0pCy6gh7Z%252B1hZJT2CnjLeHVORGDQ%3D%3D; Datasheet: Datasheets/resistors/PYu-RC_Group_51_RoHS_L_11.pdf; Last changed: 27.10.2022
R70 = 0402-0.0625W-47K-100ppm±1%: NameFromManufacturer: RC0402FR-0747KL; Manufacturer: Yageo; Place: *); Value: 47K; Tolerance: 1%; Check: False; Case: R0402; Part Number: 0402-0.0625W-47K-100ppm±1%; Temperature: -55°C~155°C; ComponentLink1Description: DATASHEET; ComponentLink1URL: https://www.terraelectronica.ru/pdf/show?pdf_file=%252Fds%252Fpdf%252FR%252FRC0402.pdf; Datasheet: Datasheets/resistors/PYu-RC_Group_51_RoHS_L_12.pdf; Last changed: 27.10.2022
R72 R85 R86 R88 = 0402-0.0625W-0R-100ppm±5%: NameFromManufacturer: RC0402JR-070RL; Manufacturer: Yageo; Place: *); Value: 0R; Tolerance: 5%; Check: False; Case: R0402; Part Number: 0402-0.0625W-0R-100ppm±5%; Temperature: -55°C~155°C; ComponentLink1Description: DATASHEET; ComponentLink1URL: https://ru.mouser.com/ProductDetail/YAGEO/RC0402JR-070RL?qs=%2Fha2pyFadugNN0LzwXn2qP7HsQ9BBU71VWxeSOFlFaYv9aVJHghTrg%3D%3D; Datasheet: Datasheets/resistors/PYu-RC_Group_51_RoHS_L_11.pdf; Last changed: 27.10.2022
R73 R75-R79 = 0402-0.0625W-22R-100ppm±1%: Chip Resistor 0402 22Ω ±1% 50V ±100ppm/℃ Thick Film; NameFromManufacturer: RC0402FR-0722RL; Manufacturer: Yageo; Place: *); Value: 22R; Check: False; Case: R0402; Part Number: 0402-0.0625W-22R-100ppm±1%; Tolerance: 1%; Temperature: -55°C~155°C; ComponentLink1Description: DATASHEET; ComponentLink1URL: https://www.yageo.com/upload/media/product/productsearch/datasheet/rchip/PYu-RC_Group_51_RoHS_L_11.pdf; Datasheet: Datasheets/resistors/PYu-RC_Group_51_RoHS_L_11.pdf; Last changed: 27.10.2022
R81 R82 = 0402-0.0625W-2.2K-100ppm±5%: as R108 on sheet CPU_GPIO; Case: R0402; Part Number: 0402-0.0625W-2.2K-100ppm±5%; Temperature: -55°C~155°C; ComponentLink1Description: DATASHEET; ComponentLink1URL: https://octopart.com/ac0402jr-072k2l-yageo-23514430?r=sp; Datasheet: Datasheets/resistors/PYu-AC_51_RoHS_L_8.pdf; Last changed: 27.10.2022
VD11-VD17 = ESD5451N: Bidirectional TVS Diode 5V; Manufacturer: Tech Public Co.; Place: *); Check: False; Part Number: ESD5451N; Value: ESD5451N; Temperature: -65°C~150°C; ComponentLink1Description: DATASHEET; NameFromManufacturer: ESD5451N; Last changed: 13.04.2023
VT1-VT3 = MMBT3904: as VT11 on sheet CPU_GPIO; Part Number: MMBT3904; Value: MMBT3904; Temperature: -55°C~150°C; ComponentLink1Description: DATASHEET; NameFromManufacturer: MMBT3904; ComponentLink1URL: https://www.terraelectronica.ru/product/607582; Datasheet: #https://diotec.com/request/datasheet/mmbt3904.pdf#; Last changeв: 01.09.2022
X2 X4 = PLS-2: Terminal block 2; Manufacturer: NXU; Place: T; Check: False; Part Number: PLS-2; Value: PLS-2; Temperature: -25°C~85°C; ComponentLink1Description: DATASHEET; NameFromManufacturer: PLS-2; Datasheet: Datasheets/connectors/pld_pls_01.pdf; Last changed: 27.10.2022
X3 = L-KLS1-TF-003: L-KLS1-TF-003 Push-Push H1.85mm With CD Pin Micro SD Card Connector; Manufacturer: KLS; Check: False; Part Number: L-KLS1-TF-003; Value: L-KLS1-TF-003; NameFromManufacturer: L-KLS1-TF-003